# Altium project zxevo.PrjPcb (part 1 of 2)
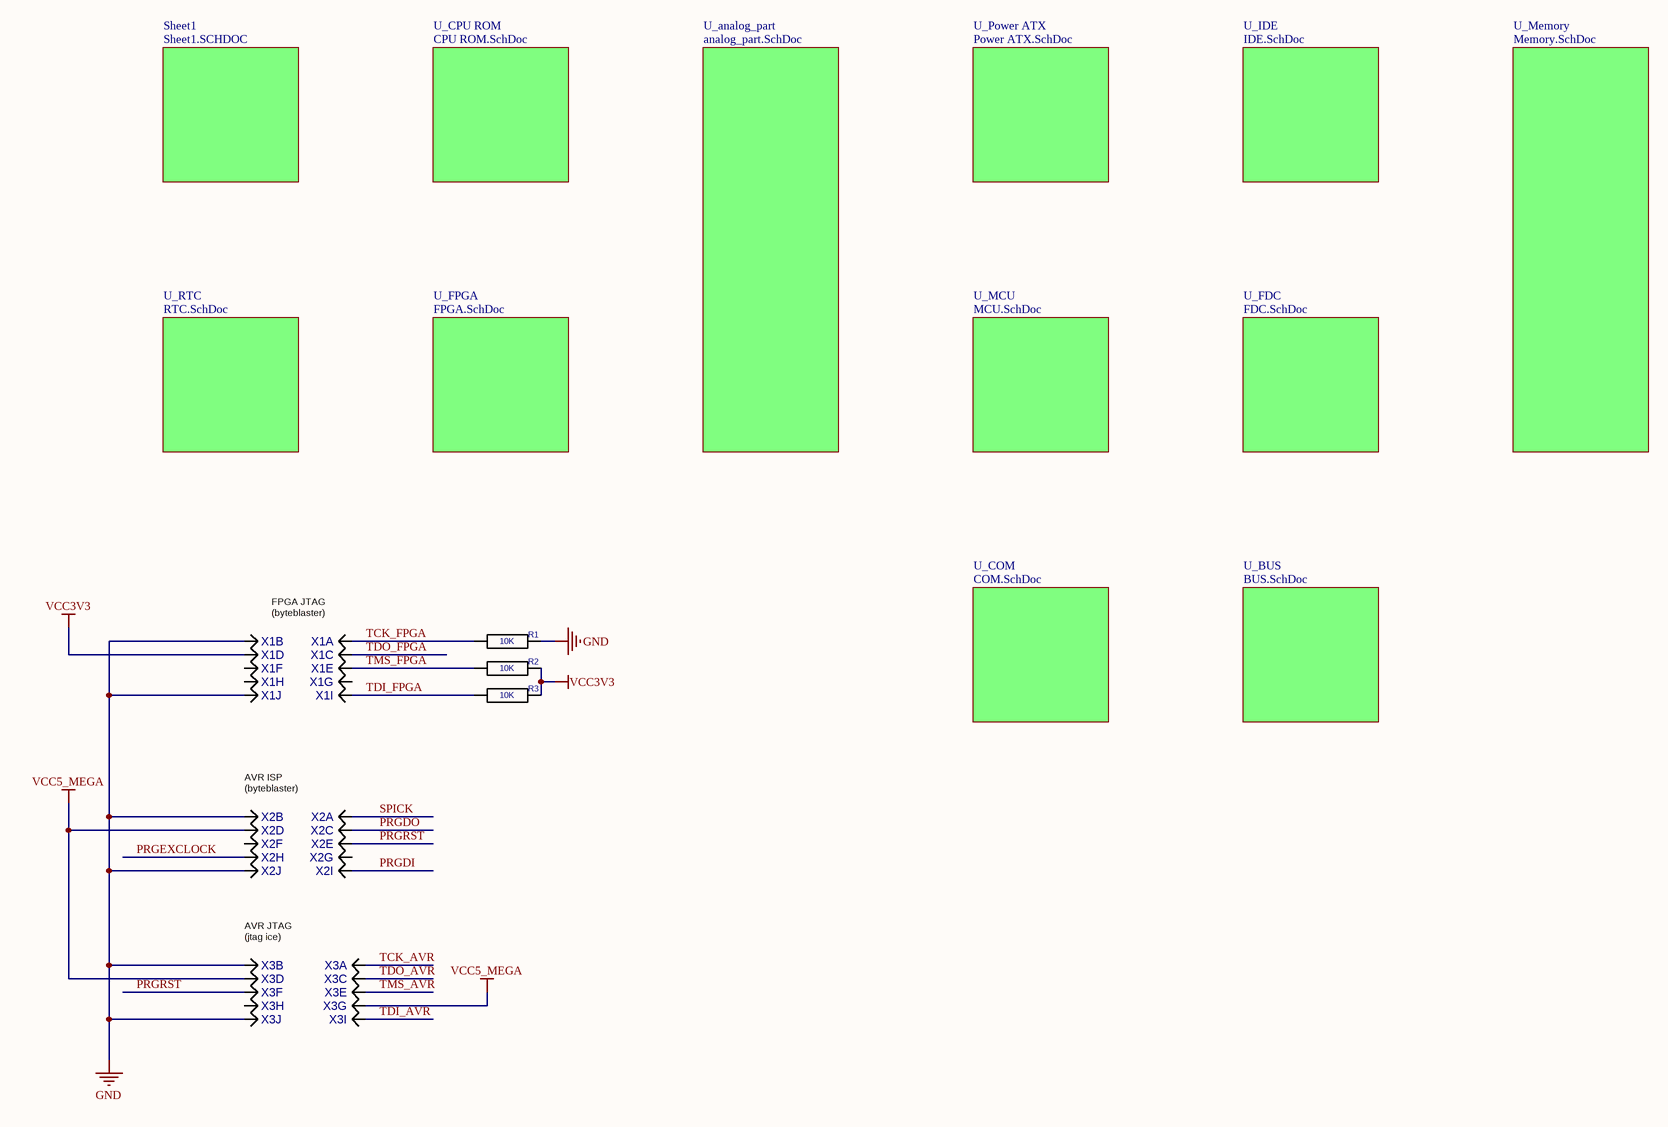
[diagram p0: First_Sheet.SCHDOC]
16 sheets, 260 parts. Net scope: global (net labels, ports and power ports of the same name join across sheets).
Board file: zxevo_c2.PcbDoc
Sheets:
  First_Sheet.SCHDOC
    Sheet1 = Sheet1.SCHDOC
    U_analog_part = analog_part.SchDoc
      U_Tape = Tape.SchDoc
      U_AY Amp = AY Amp.SchDoc
      U_Video out = Video out.SchDoc
    U_Power ATX = Power ATX.SchDoc
    U_RTC = RTC.SchDoc
    U_FPGA = FPGA.SchDoc
    U_MCU = MCU.SchDoc
    U_IDE = IDE.SchDoc
    U_FDC = FDC.SchDoc
    U_Memory = Memory.SchDoc
    U_COM = COM.SchDoc
    U_BUS = BUS.SchDoc
    U_CPU ROM = CPU ROM.SchDoc

## Sheet First_Sheet.SCHDOC
size 558 x 431 mm

### Parts
R1  value 10K  [R-CHIP]  (hidden comment: RESCHIP)
R2  value 10K  [R-CHIP]  (hidden comment: RESCHIP)
R3  value 10K  [R-CHIP]  (hidden comment: RESCHIP)
X1  IDC10M  [IDC10M]  (value not drawn)  (parts A,B,C,D,E,F,G,H,I,J of 10)
X2  IDC10M  [IDC10M]  (value not drawn)  (parts A,B,C,D,E,F,G,H,I,J of 10)
X3  IDC10M  [IDC10M]  (value not drawn)  (parts A,B,C,D,E,F,G,H,I,J of 10)

### Sub-sheets
Sheet1 = Sheet1.SCHDOC: no entries
U_analog_part = analog_part.SchDoc: no entries
U_BUS = BUS.SchDoc: no entries
U_COM = COM.SchDoc: no entries
U_CPU ROM = CPU ROM.SchDoc: no entries
U_FDC = FDC.SchDoc: no entries
U_FPGA = FPGA.SchDoc: no entries
U_IDE = IDE.SchDoc: no entries
U_MCU = MCU.SchDoc: no entries
U_Memory = Memory.SchDoc: no entries
U_Power ATX = Power ATX.SchDoc: no entries
U_RTC = RTC.SchDoc: no entries

### Nets
GND: R1.2(i/o1) X1.2 X1.10 X2.2 X2.10 X3.2 X3.10
VCC3V3: R2.2(i/o1) R3.2(i/o1) X1.4
VCC5_MEGA: X2.4 X3.4 X3.7
~{PRGRST}: X2.5 X3.6
PRGDI: X2.9
PRGDO: X2.3
PRGEXCLOCK: X2.8
SPICK: X2.1
TCK_AVR: X3.1
TCK_FPGA: R1.1(i/o) X1.1
TDI_AVR: X3.9
TDI_FPGA: R3.1(i/o) X1.9
TDO_AVR: X3.3
TDO_FPGA: X1.3
TMS_AVR: X3.5
TMS_FPGA: R2.1(i/o) X1.5

Not connected (* = marked no-connect by the designer): X1 6 7 8; X2 6 7; X3 8

### Notes on the sheet
- (near X1) FPGA JTAG
  (byteblaster)
- (near X2) AVR ISP
  (byteblaster)
- (near X3) AVR JTAG
  (jtag ice)

### Library data of the parts
X1-X3 = IDC10M: Value: *

## Sheet Sheet1.SCHDOC: ZX Evoliution
size 558 x 431 mm; Author: NedoPC; CompanyName: NedoPC; Revision: C; SheetNumber: 1; SheetTotal: 2; DocumentName: Sheet1.SCHDOC
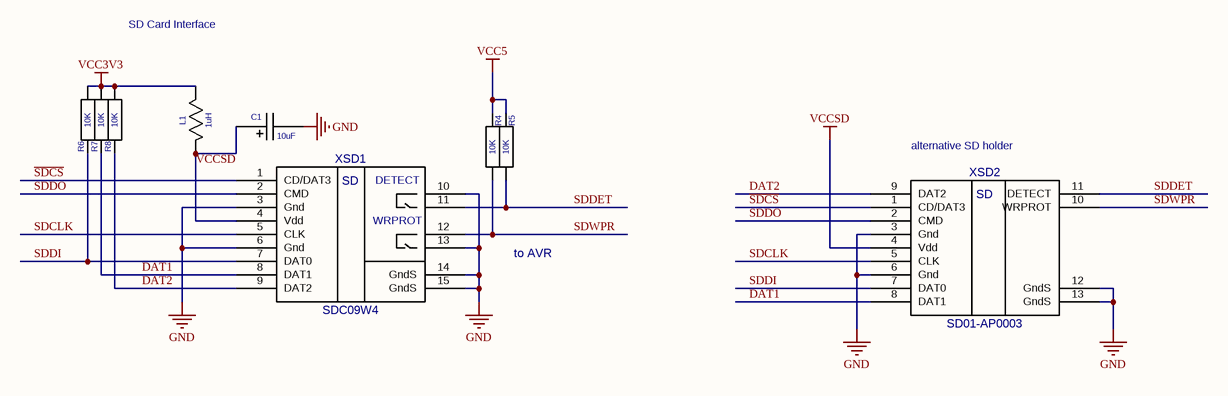
[diagram p1: Sheet1.SCHDOC]

### Parts
C1  value 10uF  [EC-CHIP]  (hidden comment: ECAPCHIP)
L1  value 1uH  [L-CHIP]  (hidden comment: L-CHIP)
R4  value 10K  [R-CHIP]  (hidden comment: RESCHIP)
R5  value 10K  [R-CHIP]  (hidden comment: RESCHIP)
R6  value 10K  [R-CHIP]  (hidden comment: RESCHIP)
R7  value 10K  [R-CHIP]  (hidden comment: RESCHIP)
R8  value 10K  [R-CHIP]  (hidden comment: RESCHIP)
XSD1  SDC09W4  [SDC09W4]
XSD2  SD01-AP0003  [SD01-AP0003]

### Nets
GND: C1.2 XSD1.3(Gnd) XSD1.6(Gnd) XSD1.10(DETECT) XSD1.13(WRPROT) XSD1.14(GndS) XSD1.15(GndS) XSD2.3(Gnd) XSD2.6(Gnd) XSD2.12(GndS) XSD2.13(GndS)
VCC3V3: L1.1 R6.1(i/o) R7.1(i/o) R8.1(i/o)
VCC5: R4.2(i/o1) R5.2(i/o1)
VCCSD: C1.1 L1.2 XSD1.4(Vdd) XSD2.4(Vdd)
DAT1: R7.2(i/o1) XSD1.8(DAT1) XSD2.8(DAT1)
DAT2: R8.2(i/o1) XSD1.9(DAT2) XSD2.9(DAT2)
~{SDCS}: XSD1.1(CD/DAT3) XSD2.1(CD/DAT3)
SDCLK: XSD1.5(CLK) XSD2.5(CLK)
SDDET: R5.1(i/o) XSD1.11(DETECT) XSD2.11(DETECT)
SDDI: R6.2(i/o1) XSD1.7(DAT0) XSD2.7(DAT0)
SDDO: XSD1.2(CMD) XSD2.2(CMD)
SDWPR: R4.1(i/o) XSD1.12(WRPROT) XSD2.10(WRPROT)

Not connected (* = marked no-connect by the designer): XSD2 14 15

### Notes on the sheet
- SD Card Interface
- (near XSD2) alternative SD holder
- to AVR
- A
- B
- C
- D
- E
- F
- 1
- 2
- 3
- 4
- Title
- Size
- A2
- Company
- Rev
- Date
- Filename
- Drawn by
- Sheet
- of
- (in symbol SD01-AP0003) SD
- (in symbol SDC09W4) SD

### Library data of the parts
XSD1 = SDC09W4: Value: *
XSD2 = SD01-AP0003: Value: *

## Sheet analog_part.SchDoc
size A4
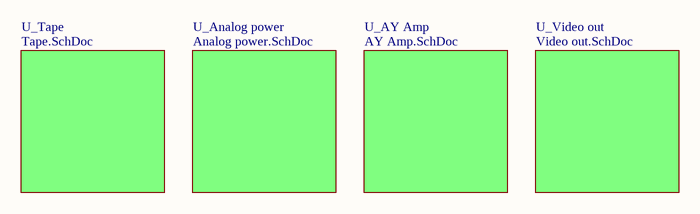
[diagram p2: analog_part.SchDoc]

### Sub-sheets
U_Analog power = Analog power.SchDoc (file not in this document): no entries
U_AY Amp = AY Amp.SchDoc: no entries
U_Tape = Tape.SchDoc: no entries
U_Video out = Video out.SchDoc: no entries

## Sheet Tape.SchDoc
size A4
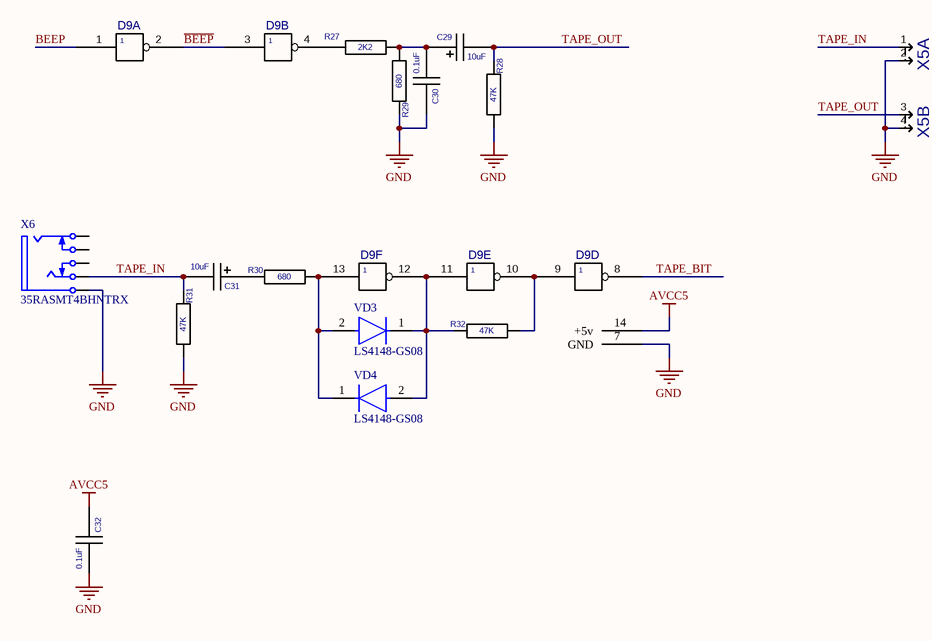
[diagram p3: Tape.SchDoc]

### Parts
C29  value 10uF  [EC-CHIP]  (hidden comment: ECAPCHIP)
C30  value 0.1uF  [C-CHIP]  (hidden comment: CAPCHIP)
C31  value 10uF  [EC-CHIP]  (hidden comment: ECAPCHIP)
C32  value 0.1uF  [C-CHIP]  (hidden comment: CAPCHIP)
D9  CD4069M  [SO14]  (value not drawn)  (parts A,B,D,E,F of 6)
R27  value 2K2  [R-CHIP]  (hidden comment: RESCHIP)
R28  value 47K  [R-CHIP]  (hidden comment: RESCHIP)
R29  value 680  [R-CHIP]  (hidden comment: RESCHIP)
R30  value 680  [R-CHIP]  (hidden comment: RESCHIP)
R31  value 47K  [R-CHIP]  (hidden comment: RESCHIP)
R32  value 47K  [R-CHIP]  (hidden comment: RESCHIP)
VD3  LS4148-GS08  [FP-6_560-5006_01-4-MFG]
VD4  LS4148-GS08  [FP-6_560-5006_01-4-MFG]
X5  PLB2-2  [PLB2-2]  (value not drawn)  (parts A,B of 2)
X6  35RASMT4BHNTRX  [SWIT-35RASMT4BHNTRX_V]

### Nets
AGND: D9.7(GND)
AVCC5: C32.1 D9.14(+5v)
GND: C30.1 C32.2 D9.7(GND) R28.1(i/o) R29.2(i/o1) R31.1(i/o) X5.2 X5.4 X6.1
~{BEEP}: D9.2 D9.3
BEEP: D9.1
TAPE_BIT: D9.8
TAPE_IN: C31.2 R31.2(i/o1) X5.1 X6.3
TAPE_OUT: C29.2 R28.2(i/o1) X5.3
NetC29_1: C29.1 C30.2 R27.1(i/o) R29.1(i/o)
NetC31_1: C31.1 R30.2(i/o1)
NetD9_4: D9.4 R27.2(i/o1)
NetD9_9: D9.9 D9.10 R32.1(i/o)
NetD9_11: D9.11 D9.12 R32.2(i/o1) VD3.1(C) VD4.2(A)
NetD9_13: D9.13 R30.1(i/o) VD3.2(A) VD4.1(C)

Not connected (* = marked no-connect by the designer): X6 2 4 5

### Library data of the parts
VD3 VD4 = CMP-02540-000025-1: DIODE GEN PURP 75V 150MA SOD80; Manufacturer: Vishay Semiconductor Diodes Division; Max Junction Temp: +175°C; Capacitance: 4pF; Value: 4pF; Forward Current: 300mA; Peak Reverse Current: 5uA; Max Repetitive Reverse Voltage: 100V; Automotive Grade: Grade 0; Max Surge Forward Current: 2A; RoHS: TRUE; Mouser Description: LS4148 Series 100 V 150 mA Small Signal Fast Switching Diode - QuadroMELF SOD-80; Octopart: https://octopart.com/ls4148-gs08-vishay-55401771; Height: 1.6mm; Reverse Voltage: 75V; Temperature Range High: +175°C; Device Class L2: Diodes; Category: Diode; Temperature: to +175°C; Device Class L3: Rectifier Diodes; Automotive: Yes; Device Class L1: Discrete Semiconductors; ComponentLink2URL: http://www.vishay.com/docs/85561/ls4148.pdf; Manufacturer Part Number: LS4148-GS08; Package: 6.560-5006.01-4; Lead Free: Yes; ComponentLink2Description: Datasheet; Digikey Description: DIODE GEN PURP 75V 150MA SOD80
X6 = CMP-1772-00001-1: Female 3.5 mm Phone Jack, 5 Position, Height 5 mm, RoHS, Tape and Reel; Current Rating: 50 mA; Voltage Rating (DC): 12 V; ComponentLink1URL: http://www.switchcraft.com/; ComponentLink2Description: Datasheet; ComponentLink2URL: http://www.switchcraft.com/Drawings/35rasmt4bhntrx_cd.pdf; PackageDescription: Female 3.5 mm Phone Jack, 5 Position, Height 5 mm; PackageReference: 35RASMT4BHNTRX; Mount: Through Hole; DatasheetVersion: Rev. C, 07/2014; Contact Material: Silver; ComponentLink1Description: Manufacturer URL; Packaging: Tape and Reel; RoHSCompliant: true; Contact Plating: Silver; Package Quantity: 3000
X5 = PLB2-2: Value: *

## Sheet AY Amp.SchDoc
size A3
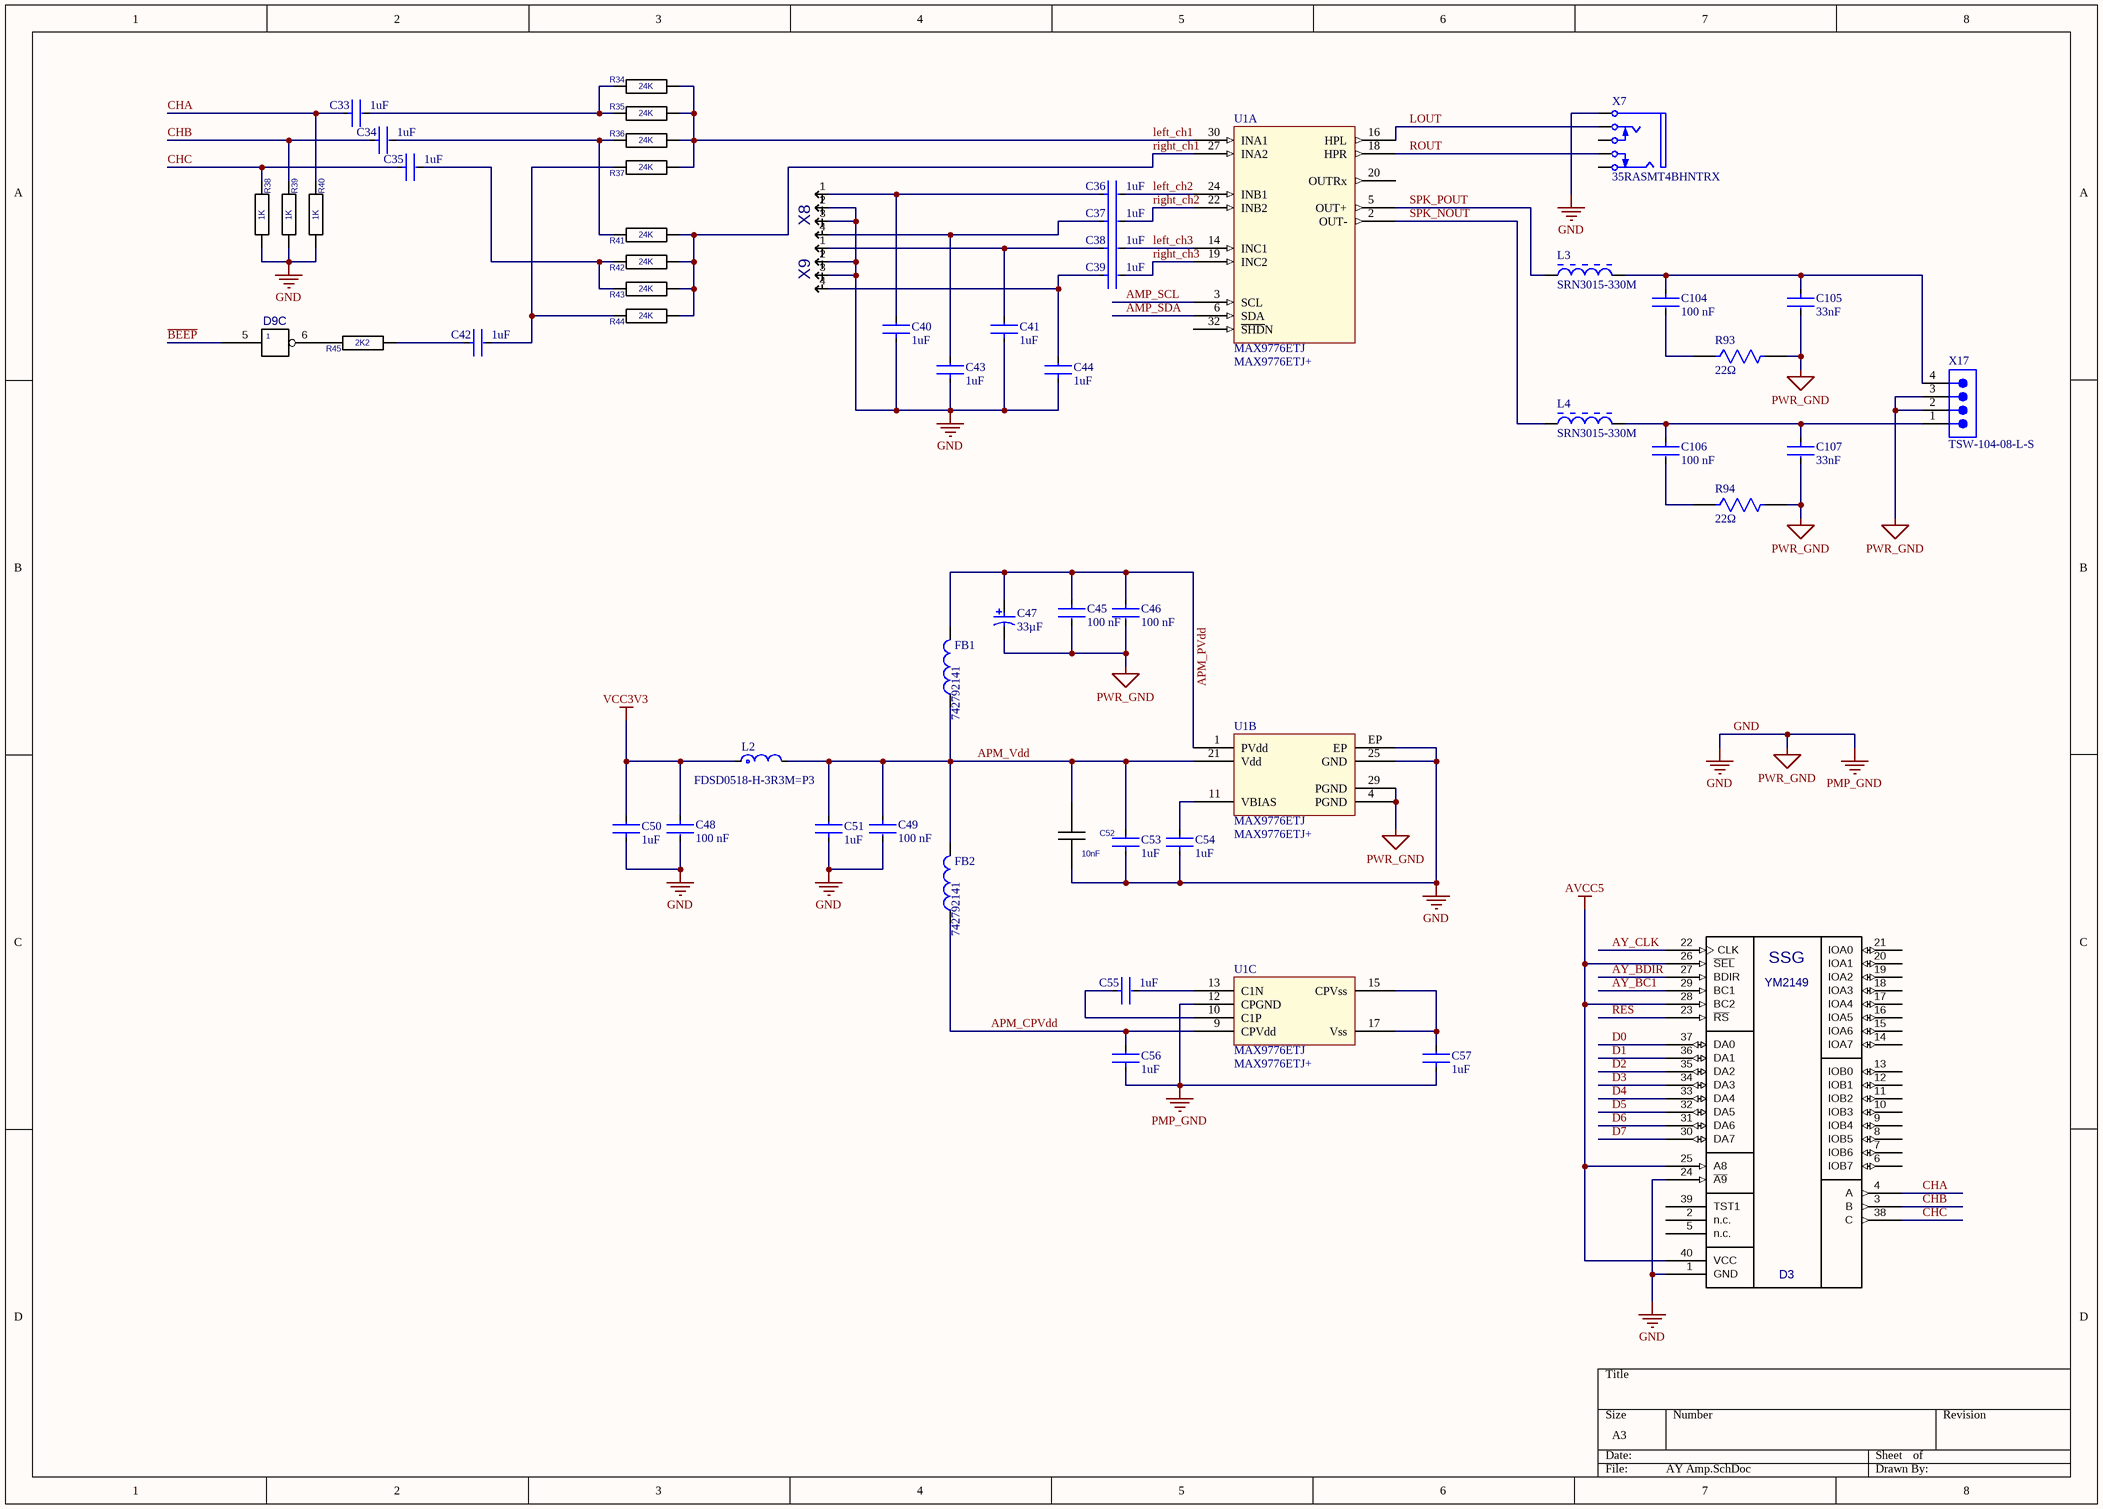
[diagram p4: AY Amp.SchDoc]

### Parts
C33  Capacitance: 1uF  [FP-GCM21B-0_15-IPC_A]  (hidden comment: GCM21BR71E105KA56L)
C34  Capacitance: 1uF  [FP-GCM21B-0_15-IPC_A]  (hidden comment: GCM21BR71E105KA56L)
C35  Capacitance: 1uF  [FP-GCM21B-0_15-IPC_A]  (hidden comment: GCM21BR71E105KA56L)
C36  Capacitance: 1uF  [FP-GCM21B-0_15-IPC_A]  (hidden comment: GCM21BR71E105KA56L)
C37  Capacitance: 1uF  [FP-GCM21B-0_15-IPC_A]  (hidden comment: GCM21BR71E105KA56L)
C38  Capacitance: 1uF  [FP-GCM21B-0_15-IPC_A]  (hidden comment: GCM21BR71E105KA56L)
C39  Capacitance: 1uF  [FP-GCM21B-0_15-IPC_A]  (hidden comment: GCM21BR71E105KA56L)
C40  Capacitance: 1uF  [FP-GCM21B-0_15-IPC_A]  (hidden comment: GCM21BR71E105KA56L)
C41  Capacitance: 1uF  [FP-GCM21B-0_15-IPC_A]  (hidden comment: GCM21BR71E105KA56L)
C42  Capacitance: 1uF  [FP-GCM21B-0_15-IPC_A]  (hidden comment: GCM21BR71E105KA56L)
C43  Capacitance: 1uF  [FP-GCM21B-0_15-IPC_A]  (hidden comment: GCM21BR71E105KA56L)
C44  Capacitance: 1uF  [FP-GCM21B-0_15-IPC_A]  (hidden comment: GCM21BR71E105KA56L)
C45  Capacitance: 100 nF  [FP-CC0805-0_85-IPC_A]  (hidden comment: CC0805KRX7R8BB104)
C46  Capacitance: 100 nF  [FP-CC0805-0_85-IPC_A]  (hidden comment: CC0805KRX7R8BB104)
C47  Capacitance: 33µF  [CAPMP3529X21-T_V]  (hidden comment: TAJB336K016RNJ)
C48  Capacitance: 100 nF  [FP-CC0805-0_85-IPC_A]  (hidden comment: CC0805KRX7R8BB104)
C49  Capacitance: 100 nF  [FP-CC0805-0_85-IPC_A]  (hidden comment: CC0805KRX7R8BB104)
C50  Capacitance: 1uF  [FP-GCM21B-0_15-IPC_A]  (hidden comment: GCM21BR71E105KA56L)
C51  Capacitance: 1uF  [FP-GCM21B-0_15-IPC_A]  (hidden comment: GCM21BR71E105KA56L)
C52  value 10nF  [C-CHIP]  (hidden comment: CAPCHIP)
C53  Capacitance: 1uF  [FP-GCM21B-0_15-IPC_A]  (hidden comment: GCM21BR71E105KA56L)
C54  Capacitance: 1uF  [FP-GCM21B-0_15-IPC_A]  (hidden comment: GCM21BR71E105KA56L)
C55  Capacitance: 1uF  [FP-GCM21B-0_15-IPC_A]  (hidden comment: GCM21BR71E105KA56L)
C56  Capacitance: 1uF  [FP-GCM21B-0_15-IPC_A]  (hidden comment: GCM21BR71E105KA56L)
C57  Capacitance: 1uF  [FP-GCM21B-0_15-IPC_A]  (hidden comment: GCM21BR71E105KA56L)
C104  Capacitance: 100 nF  [FP-CC0805-0_85-IPC_A]  (hidden comment: CC0805KRX7R8BB104)
C105  Capacitance: 33nF  [FP-CL21-IPC_A]  (hidden comment: CL21B333KBANNNC)
C106  Capacitance: 100 nF  [FP-CC0805-0_85-IPC_A]  (hidden comment: CC0805KRX7R8BB104)
C107  Capacitance: 33nF  [FP-CL21-IPC_A]  (hidden comment: CL21B333KBANNNC)
D3  YM2149  [DIP40]
D9  CD4069M  [SO14]  (value not drawn)  (part C of 6)
FB1  742792141  [SMD-1206]
FB2  742792141  [SMD-1206]
L2  FDSD0518-H-3R3M=P3  [FP-FDSD0518-MFG]
L3  SRN3015-330M  [BOUR-SRN3015-2_V]
L4  SRN3015-330M  [BOUR-SRN3015-2_V]
R34  value 24K  [R-CHIP]  (hidden comment: RESCHIP)
R35  value 24K  [R-CHIP]  (hidden comment: RESCHIP)
R36  value 24K  [R-CHIP]  (hidden comment: RESCHIP)
R37  value 24K  [R-CHIP]  (hidden comment: RESCHIP)
R38  value 1K  [R-CHIP]  (hidden comment: RESCHIP)
R39  value 1K  [R-CHIP]  (hidden comment: RESCHIP)
R40  value 1K  [R-CHIP]  (hidden comment: RESCHIP)
R41  value 24K  [R-CHIP]  (hidden comment: RESCHIP)
R42  value 24K  [R-CHIP]  (hidden comment: RESCHIP)
R43  value 24K  [R-CHIP]  (hidden comment: RESCHIP)
R44  value 24K  [R-CHIP]  (hidden comment: RESCHIP)
R45  value 2K2  [R-CHIP]  (hidden comment: RESCHIP)
R93  Resistance: 22Ω  [FP-AC0805-IPC_A]  (hidden comment: AC0805JR-0722RL)
R94  Resistance: 22Ω  [FP-AC0805-IPC_A]  (hidden comment: AC0805JR-0722RL)
U1  MAX9776ETJ  Supplier Part Number 1: MAX9776ETJ+  [QFN50P500X500X75_HS-33M]  (parts A,B,C of 3)
X7  35RASMT4BHNTRX  [SWIT-35RASMT4BHNTRX_V]
X8  PLB1-4I  [PLB1-4I]  (value not drawn)
X9  PLB1-4I  [PLB1-4I]  (value not drawn)
X17  TSW-104-08-L-S  [SMTC-TSW-104-08-X-S]

### Nets
AGND: D9.7(GND)
AVCC5: D3.25(A8) D3.26(~{SEL}) D3.28(BC2) D3.40(VCC) D9.14(+5v)
GND: C40.1 C41.1 C43.1 C44.1 C45.2 C46.2 C47.2 C48.2 C49.2 C50.1 C51.1 C52.2 C53.1 C54.1 C56.1 C57.1 C105.2 C107.2 D3.1(GND) D3.24(~{A9}) R38.1(i/o) R39.1(i/o) R40.1(i/o) R93.2 R94.2 U1.4(PGND) U1.12(CPGND) U1.25(GND) U1.29(PGND) U1.EP X7.1 X8.2(I/O2) X8.3(I/O3) X9.2(I/O2) X9.3(I/O3) X17.2 X17.3  [also labelled PMP_GND, PWR_GND]
VCC3V3: C48.1 C50.2 L2.1
AMP_SCL: U1.3(SCL)
AMP_SDA: U1.6(SDA)
APM_CPVdd: C56.2 FB2.1 U1.9(CPVdd)
APM_PVdd: C45.1 C46.1 C47.1 FB1.2 U1.1(PVdd)
APM_Vdd: C49.1 C51.2 C52.1 C53.2 FB1.1 FB2.2 L2.2 U1.21(Vdd)
AY_BC1: D3.29(BC1)
AY_BDIR: D3.27(BDIR)
AY_CLK: D3.22(CLK)
~{BEEP}: D9.5
CHA: C33.1 D3.4(A) R40.2(i/o1)
CHB: C34.1 D3.3(B) R39.2(i/o1)
CHC: C35.1 D3.38(C) R38.2(i/o1)
D0: D3.37(DA0)
D1: D3.36(DA1)
D2: D3.35(DA2)
D3: D3.34(DA3)
D4: D3.33(DA4)
D5: D3.32(DA5)
D6: D3.31(DA6)
D7: D3.30(DA7)
left_ch1: R34.1(i/o) R35.1(i/o) R36.1(i/o) R37.1(i/o) U1.30(INA1)
left_ch2: C36.2 U1.24(INB1)
left_ch3: C38.2 U1.14(INC1)
LOUT: U1.16(HPL) X7.3
~{RES}: D3.23(~{RS})
right_ch1: R41.1(i/o) R42.1(i/o) R43.1(i/o) R44.1(i/o) U1.27(INA2)
right_ch2: C37.2 U1.22(INB2)
right_ch3: C39.2 U1.19(INC2)
ROUT: U1.18(HPR) X7.4
SPK_NOUT: L4.1 U1.2(OUT-)
SPK_POUT: L3.1 U1.5(OUT+)
NetC33_2: C33.2 R34.2(i/o1) R35.2(i/o1)
NetC34_2: C34.2 R36.2(i/o1) R41.2(i/o1)
NetC35_2: C35.2 R42.2(i/o1) R43.2(i/o1)
NetC36_1: C36.1 C40.2 X8.1(I/O1)
NetC37_1: C37.1 C43.2 X8.4(I/O4)
NetC38_1: C38.1 C41.2 X9.1(I/O1)
NetC39_1: C39.1 C44.2 X9.4(I/O4)
NetC42_1: C42.1 R45.1(i/o)
NetC42_2: C42.2 R37.2(i/o1) R44.2(i/o1)
NetC54_2: C54.2 U1.11(VBIAS)
NetC55_1: C55.1 U1.10(C1P)
NetC55_2: C55.2 U1.13(C1N)
NetC57_2: C57.2 U1.15(CPVss) U1.17(Vss)
NetC104_1: C104.1 C105.1 L3.2 X17.4
NetC104_2: C104.2 R93.1
NetC106_1: C106.1 C107.1 L4.2 X17.1
NetC106_2: C106.2 R94.1
NetD9_6: D9.6 R45.2(i/o1)

Not connected (* = marked no-connect by the designer): D3 2(n.c.) 5(n.c.) 6(IOB7) 7(IOB6) 8(IOB5) 9(IOB4) 10(IOB3) 11(IOB2) 12(IOB1) 13(IOB0) 14(IOA7) 15(IOA6) 16(IOA5) 17(IOA4) 18(IOA3) 19(IOA2) 20(IOA1) 21(IOA0) 39(TST1); U1 7(I.C.) 8(I.C.) 20(OUTRx) 23(I.C.) 26(I.C.) 28(I.C.) 31(I.C.) 32(~{SHD}N); X7 2 5

### Notes on the sheet
- (in symbol YM2149) SSG

### Library data of the parts
C33-C44 C50 C51 C53-C57 = CMP-2007-03346-2: Ceramic Capacitor for Automotive 1uF ±10% 25VDC X7R 0805 Embossed T/R; Voltage Rating (DC): 25V; Dielectric: X7R; Max Operating Temperature: 125°C; Lead Free: Lead Free; Ratings: AEC-Q200; Voltage Rating: 25V; Case Code (Imperial): 0805; Package Quantity: 3000; Termination: SMD/SMT; Packaging: Tape and Reel; Tolerance: 10%; Length: 2mm; Voltage: 25V; Radiation Hardening: No; Depth: 1.25mm; Case/Package: 0805; Thickness: 0.055inch; Width: 0.049inch; Min Operating Temperature: -55°C; Mount: Surface Mount; REACH SVHC: No SVHC; Case Code (Metric): 2012; Height: 1.25mm
C45 C46 C48 C49 C104 C106 = CMP-1036-04410-2: CAP CER 0.1UF 25V X7R 0805; Manufacturer: Yageo; Tolerance: 0.1; Material: Ceramic; Value: 100 nF; ComponentLink2URL: http://www.yageo.com/documents/recent/UPY-GPHC_Y5V_6.3V-to-50V_8.pdf; Category: Cap; Mouser Description: Multilayer Ceramic Capacitors MLCC - SMD/SMT 100nF 25V X7R 10%; Manufacturer Part Number: CC0805KRX7R8BB104; Device Class L1: Passive Components; Footprint Url: http://www.yageo.com/exep/pages/download/literatures/UPY-C_GEN_24.pdf; Height: 0.95mm; Digikey Description: CAP CER 0.1UF 25V X7R 0805; Lead Free: Yes; Temperature Range High: +85°C; Temperature: -30°C to +85°C; Ipc Land Pattern Name: CAPC200125X85; Automotive: No; Octopart: https://octopart.com/cc0805krx7r8bb104-yageo-39467766; Device Class L2: Capacitors; Temperature Characteristic: X7R; Voltage Rating: 25 V; ComponentLink2Description: Datasheet; Temperature Range Low: -30°C; Device Class L3: Ceramic Capacitors; RoHS: TRUE; Package: CC0805-0.85
C47 = CMP-2000-07224-1: Standard Tantalum, 33 uF, +/- 10%, 16 V, -55 to 125 degC, 2-Pin SMD, RoHS, Tape and Reel; Manufacturer: AVX; Manufacturer Size Code: B; PCN Part Number: TAJSeriesSuffix08/Dec/2008; Other Names: 478-1688-1; Kits: 478-3443-ND-KITTANTCAPTAJSERIES; Product Training Modules: ComponentSolutionsforSmartMeterApplications; Catalog Drawings: TAJSeriesSideTAJSeries; ESR (Equivalent Series Resistance): 2.1Ohm; EDA / CAD Models: DownloadfromAcceleratedDesigns; Voltage - Rated: 16V; Type: Molded; Online Catalog: TAJSeries; Lead Spacing: -; Family: TantalumCapacitors; Series: TAJ; Package Reference: CAPMP3529X21-T; Package / Case: 1210(3528Metric); Category: Capacitors; Packaging: CutTape(CT); Lifetime @ Temp.: -; Package URL: http://www.avx.com/download/software/literature/AVX-Footprint-Library.pdf; Tolerance: ±10%; Manufacturer URL: http://www.avx.com/; Package Description: 2-Pin Surface Mount Device, Body 3.5 x 2.85 mm; Features: GeneralPurpose; Height - Seated (Max): 0.083"(2.10mm); Mounting Technology: SurfaceMount; Datasheet Version: 02/2016; Datasheet URL: http://datasheets.avx.com/TAJ.pdf; Operating Temperature: -55°C~125°C; Standard Package: 1; Size / Dimension: 0.138"Lx0.110"W(3.50mmx2.80mm); Mounting Type: SurfaceMount
C105 C107 = CMP-13271-001257-1: CL21 Series 0805 33nF 50V ±10% Tolerance X7R Multilayer Ceramic Chip Capacitor; Lead Free: Lead Free; Case Code (Imperial): 0805; Case/Package: 0805; Depth: 1.25mm; Package Quantity: 1; Radiation Hardening: No; Max Operating Temperature: 125°C; Min Operating Temperature: -55°C; Length: 2mm; Voltage Rating (DC): 50V; Material: Ceramic; Thickness: 0.03inch; Height: 0.65mm; Voltage Rating: 50V; Dielectric: X7R; Mount: Surface Mount; Voltage: 50V; Tolerance: 10%; Width: 0.049inch; Case Code (Metric): 2012; Packaging: Tape and Reel
FB1 FB2 = CMP-0220-00011-1: SMD EMI Suppression Ferrite Bead WE-CBF, Z = 1000 Ohm; Impedance: 1000 Ohm; PackageReference: SMD-1206; ComponentLink1URL: http://www.we-online.com; PackageVersion: 2007; DatasheetVersion: Dec-2005; ComponentLink1Description: Manufacturer Link; PackageDescription: Chip Inductor, 2-Leads, Body 3.2 x 1.6 mm; ComponentLink2Description: Datasheet; ComponentLink2URL: http://www.we-online.de/katalog/media/pdf/742792141.pdf
L2 = CMP-06042-016056-1: FIXED IND 3.3UH 3.4A 58 MOHM SMD; Tolerance: 20%; Saturation Current: 4.6A; DC Resistance (DCR): 58mR; Test Frequency: 100kHz; Shielding: Shielded; Core Material: Ferrite; Packaging: Tape and Reel; Current Rating: 3.4A; Resistor Type: Wirewound; Depth: 4.9mm; Inductance: 3.3uH; Width: 0.193inch; RoHS Compliant: Yes; Height - Seated (Max): 0.071inch; Mount: Surface Mount; Length: 0.205inch; Case/Package: Nonstandard; Max DC Current: 3.4A
L3 L4 = CMP-0007-00002-1: Semi-shielded Power Inductor, 33 uH, +/- 20%, 0.5 A, -40 to 125 degC, 3 x 3 x 1.5 mm SMD, RoHS and Halogen Free, Tape and Reel; Manufacturer: Bourns; DCR Max: 0.959 Ohm; Resistance to Solder Heat: +260 degC for 10 sec.; Inductance: 33 uH; Isat: 0.46 A; Rated current: 0.5 A; SRF Min: 22 MHz; Inductance tolerance: +/- 20%; Packing: Tape and Reel; PackageDescription: 2-Pin SMD, Body 3 x 3 mm, Height 1.5 mm; Operating Temperature: -40 to 125 degC; Mounting Technology: Surface Mount; ComponentLink3Description: Package Specification; DatasheetVersion: Aug-11; ComponentLink3URL: http://www.bourns.com/data/global/pdfs/SRN3015.pdf; RoHS: TRUE; PartNumber: SRN3015-330M; ComponentLink2Description: Datasheet; ComponentLink2URL: http://www.bourns.com/data/global/pdfs/SRN3015.pdf; ComponentLink1Description: Manufacturer URL; PackageReference: SRN3015; ComponentLink1URL: http://www.bourns.com/
R93 R94 = CMP-03412-037428-1: RES SMD 22 OHM 5% 1/8W 0805; Manufacturer: Yageo; Value: 22Ω; Automotive Grade: Grade 0; Voltage Rating: 150V; Tolerance: 0.05; Temperature Range High: +155°C; Ipc Land Pattern Name: RESC200125X50; Series: AC; Temperature: -55°C to +155°C; Octopart: https://octopart.com/ac0805jr-0722rl-yageo-25972001; Digikey Description: RES SMD 22 OHM 5% 1/8W 0805; Height: 0.6mm; ComponentLink2URL: http://www.yageo.com/documents/recent/PYu-AC_51_RoHS_L_6.pdf; Composition: Thick Film; Automotive: Yes; Mouser Description: Thick Film Resistors 1/8W 22ohm 5% AEC-Q200; Device Class L3: Chip SMD Resistors; Device Class L2: Resistors; Power Rating: 1/8W; Device Class L1: Passive Components; Category: Res; RoHS: TRUE; ComponentLink2Description: Datasheet; Temperature Range Low: -55°C; Package: AC0805; Footprint Url: http://www.yageo.com/exep/pages/download/literatures/PYu-R_Mount_10.pdf; Lead Free: Yes; Manufacturer Part Number: AC0805JR-0722RL
U1 = MAX9776ETJ: Audio Amp Headphone/Receiver/Speaker 1-CH Mono/2-CH Stereo 1.5W Class-D 32-Pin TQFN EP; Manufacturer: Maxim; Voltage Gain: 12dB; Min Dual Supply Voltage: 2.7V; Max Dual Supply Voltage: 5.5V; Power Supply Rejection Ratio (PSRR): 80dB; Common Mode Rejection Ratio: 45dB; Max Power Dissipation: 1.36W; Nominal Supply Current: 9.5mA; Dual Supply Voltage: 5V; Supply Type: Triple; Gain Bandwidth Product: 20kHz; Manufacturer Part Number: MAX9776ETJ+; RoHS: Yes; Category: Amplifiers - Audio; Stock 1: 240; Mount: Surface Mount; Number of Pins: 32; Min Operating Temperature: -40°C; Max Operating Temperature: 85°C; Packaging: Rail/Tube; Max Output Power: 1.5W; Package Quantity: 1; Logic Function: Receiver; Features: I²C; Output Power: 1.5W; Max Supply Voltage: 5.5V; Min Supply Voltage: 2.7V; Series: DirectDrive®; Supply Current: 9.5mA; Length: 5.1mm; Width: 5.1mm; Height: 0.75mm; Radiation Hardening: No; RoHS Compliant: Yes; ComponentLink1URL: https://datasheet.ciiva.com/1790/max9775-max9776-1790309.pdf?src-supplier=Digi-Key; ComponentLink1Description: https://datasheet.ciiva.com/1790/max9775-max9776-1790309.pdf?src-supplier=Digi-Key; ComponentLink2URL: https://datasheet.ciiva.com/17309/max9775-max9776-17309659.pdf?src-supplier=Avnet+Europe; ComponentLink2Description: https://datasheet.ciiva.com/17309/max9775-max9776-17309659.pdf?src-supplier=Avnet+Europe; ComponentLink3URL: https://datasheet.ciiva.com/2967/max9775-max9776-2967997.pdf?src-supplier=Avnet; ComponentLink3Description: https://datasheet.ciiva.com/2967/max9775-max9776-2967997.pdf?src-supplier=Avnet
X7 = CMP-1772-00001-1: as X6 on sheet Tape; ComponentLink1URL: http://www.switchcraft.com/; ComponentLink2Description: Datasheet; ComponentLink2URL: http://www.switchcraft.com/Drawings/35rasmt4bhntrx_cd.pdf; PackageDescription: Female 3.5 mm Phone Jack, 5 Position, Height 5 mm; PackageReference: 35RASMT4BHNTRX; Mount: Through Hole; DatasheetVersion: Rev. C, 07/2014; Contact Material: Silver; ComponentLink1Description: Manufacturer URL; Packaging: Tape and Reel; RoHSCompliant: true; Contact Plating: Silver; Package Quantity: 3000
X17 = CMP-1024-00358-1: 0.025" SQ Post Header, Through-hole, Vertical, -55 to 125 degC, 2.54 mm Pitch, 4-Pin, Male, RoHS; Manufacturer: Samtec; Pitch: 2.54 mm; PartNumber: TSW-104-08-L-S; RoHS: True; Temperature Range: -55 to 125 degC; PackageDescription: .025[0.64] SQ. Post Terminal Strip Assembly; Orientation: Vertical; ComponentLink2URL: http://www.samtec.com/documents/webfiles/pdf/TSW_TH.PDF; ComponentLink1Description: Manufacturer URL; ComponentLink2Description: Datasheet; PackageVersion: DM, 8/1988; ComponentLink3URL: http://www.samtec.com/documents/webfiles/cpdf/TSW-XXX-XX-XXX-X-XX-XXX-MKT.pdf; Mounting Technology: Through-hole; PackageReference: TSW-104-08-X-S; ComponentLink3Description: Package Specification; ComponentLink1URL: http://www.samtec.com; DatasheetVersion: F-214
D3 = YM2149: Value: *
X8 X9 = PLB1-4I: Value: *

## Sheet Video out.SchDoc
size A3
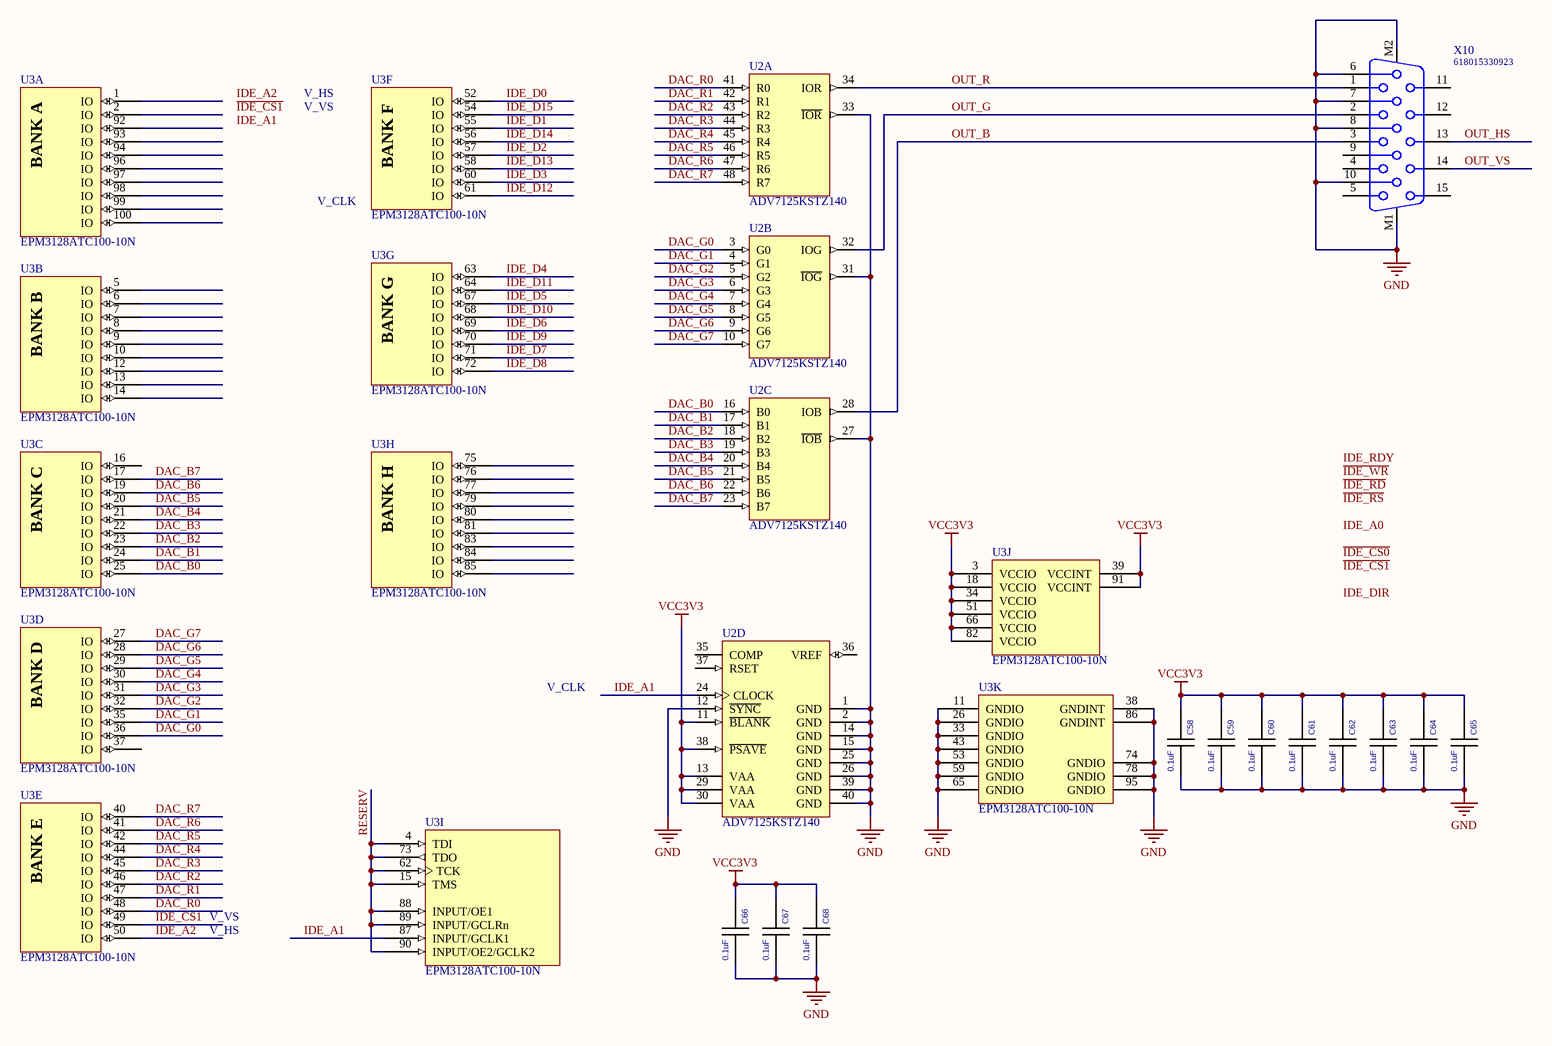
[diagram p5: Video out.SchDoc]

### Parts
C58  value 0.1uF  [C-CHIP]  (hidden comment: CAPCHIP)
C59  value 0.1uF  [C-CHIP]  (hidden comment: CAPCHIP)
C60  value 0.1uF  [C-CHIP]  (hidden comment: CAPCHIP)
C61  value 0.1uF  [C-CHIP]  (hidden comment: CAPCHIP)
C62  value 0.1uF  [C-CHIP]  (hidden comment: CAPCHIP)
C63  value 0.1uF  [C-CHIP]  (hidden comment: CAPCHIP)
C64  value 0.1uF  [C-CHIP]  (hidden comment: CAPCHIP)
C65  value 0.1uF  [C-CHIP]  (hidden comment: CAPCHIP)
C66  value 0.1uF  [C-CHIP]  (hidden comment: CAPCHIP)
C67  value 0.1uF  [C-CHIP]  (hidden comment: CAPCHIP)
C68  value 0.1uF  [C-CHIP]  (hidden comment: CAPCHIP)
U2  ADV7125KSTZ140  [ST-48_N]  (parts A,B,C,D of 4)
U3  EPM3128ATC100-10N  [ALTR-TQFP100_A-120_D1-140_L]  (parts A,B,C,D,E,F,G,H,I,J,K of 11)
X10  618015330923  [618015330923]

### Nets
GND: C58.2 C59.2 C60.2 C61.2 C62.2 C63.2 C64.2 C65.2 C66.2 C67.2 C68.2 U2.1(GND) U2.2(GND) U2.12(~{SYNC}) U2.14(GND) U2.15(GND) U2.25(GND) U2.26(GND) U2.27(~{IOB}) U2.31(~{IOG}) U2.33(~{IOR}) U2.39(GND) U2.40(GND) U3.11(GNDIO) U3.26(GNDIO) U3.33(GNDIO) U3.38(GNDINT) U3.43(GNDIO) U3.53(GNDIO) U3.59(GNDIO) U3.65(GNDIO) U3.74(GNDIO) U3.78(GNDIO) U3.86(GNDINT) U3.95(GNDIO) X10.6 X10.7 X10.8 X10.10 X10.M1 X10.M2
VCC3V3: C58.1 C59.1 C60.1 C61.1 C62.1 C63.1 C64.1 C65.1 C66.1 C67.1 C68.1 U2.11(~{BLANK}) U2.13(VAA) U2.29(VAA) U2.30(VAA) U2.38(~{PSAVE}) U3.3(VCCIO) U3.18(VCCIO) U3.34(VCCIO) U3.39(VCCINT) U3.51(VCCIO) U3.66(VCCIO) U3.82(VCCIO) U3.91(VCCINT)
DAC_B0: U2.16(B0) U3.25(IO)
DAC_B1: U2.17(B1) U3.24(IO)
DAC_B2: U2.18(B2) U3.23(IO)
DAC_B3: U2.19(B3) U3.22(IO)
DAC_B4: U2.20(B4) U3.21(IO)
DAC_B5: U2.21(B5) U3.20(IO)
DAC_B6: U2.22(B6) U3.19(IO)
DAC_B7: U2.23(B7) U3.17(IO)
DAC_G0: U2.3(G0) U3.36(IO)
DAC_G1: U2.4(G1) U3.35(IO)
DAC_G2: U2.5(G2) U3.32(IO)
DAC_G3: U2.6(G3) U3.31(IO)
DAC_G4: U2.7(G4) U3.30(IO)
DAC_G5: U2.8(G5) U3.29(IO)
DAC_G6: U2.9(G6) U3.28(IO)
DAC_G7: U2.10(G7) U3.27(IO)
DAC_R0: U2.41(R0) U3.48(IO)
DAC_R1: U2.42(R1) U3.47(IO)
DAC_R2: U2.43(R2) U3.46(IO)
DAC_R3: U2.44(R3) U3.45(IO)
DAC_R4: U2.45(R4) U3.44(IO)
DAC_R5: U2.46(R5) U3.42(IO)
DAC_R6: U2.47(R6) U3.41(IO)
DAC_R7: U2.48(R7) U3.40(IO)
~{IDE_CS1}: U3.49(IO)
IDE_A1: U2.24(CLOCK) U3.87(INPUT/GCLK1)
IDE_A2: U3.50(IO)
IDE_D0: U3.52(IO)
IDE_D1: U3.55(IO)
IDE_D2: U3.57(IO)
IDE_D3: U3.60(IO)
IDE_D4: U3.63(IO)
IDE_D5: U3.67(IO)
IDE_D6: U3.69(IO)
IDE_D7: U3.71(IO)
IDE_D8: U3.72(IO)
IDE_D9: U3.70(IO)
IDE_D10: U3.68(IO)
IDE_D11: U3.64(IO)
IDE_D12: U3.61(IO)
IDE_D13: U3.58(IO)
IDE_D14: U3.56(IO)
IDE_D15: U3.54(IO)
OUT_B: U2.28(IOB) X10.3
OUT_G: U2.32(IOG) X10.2
OUT_HS: X10.13
OUT_R: U2.34(IOR) X10.1
OUT_VS: X10.14
RESERV: U3.4(TDI) U3.15(TMS) U3.62(TCK) U3.73(TDO) U3.88(INPUT/OE1) U3.89(INPUT/GCLRn) U3.90(INPUT/OE2/GCLK2)

Not connected (* = marked no-connect by the designer): U2 35(COMP) 36(VREF) 37(RSET); U3 1(IO) 2(IO) 5(IO) 6(IO) 7(IO) 8(IO) 9(IO) 10(IO) 12(IO) 13(IO) 14(IO) 16(IO) 37(IO) 75(IO) 76(IO) 77(IO) 79(IO) 80(IO) 81(IO) 83(IO) 84(IO) 85(IO) 92(IO) 93(IO) 94(IO) 96(IO) 97(IO) 98(IO) 99(IO) 100(IO); X10 4 5 9 11 12 15

### Notes on the sheet
- V_HS
- V_VS
- V_CLK
- Labels drawn without touching a wire or pin: IDE_A0, IDE_A1, IDE_A2, IDE_DIR, IDE_RDY, ~{IDE_CS0}, ~{IDE_CS1}, ~{IDE_RD}, ~{IDE_RS}, ~{IDE_WR}
- (in symbol CMP-2000-06227-1, part A) BANK A
- (in symbol CMP-2000-06227-1, part B) BANK B
- (in symbol CMP-2000-06227-1, part C) BANK C
- (in symbol CMP-2000-06227-1, part D) BANK D
- (in symbol CMP-2000-06227-1, part E) BANK E
- (in symbol CMP-2000-06227-1, part F) BANK F
- (in symbol CMP-2000-06227-1, part G) BANK G
- (in symbol CMP-2000-06227-1, part H) BANK H

### Library data of the parts
U2 = CMP-0318-00718-2: 3 Channel 8-Bit CMOS High Speed Video Digital-to-Analog Converter, -40 to +85 degC, ST-48, Pb-Free, Tray; Manufacturer: Analog Devices; Max V+: 5.25V; Op Pwr Diss: 485mW; Resolution (Bits): 8; # DAC Outputs: 3; Single Supply: No; ComponentLink3URL: http://www.analog.com/static/imported-files/packages/PKG_PDF/LQFP%28ST%29/ST_48.pdf; PackageDescription: 48-Pin Thin Quad Flat Pack 0.5 mm Pitch; Generic Part Number: ADV7125; ComponentLink2Description: Datasheet; ComponentLink1URL: http://www.analog.com/en/index.html; ComponentLink2URL: http://www.analog.com/static/imported-files/data_sheets/ADV7125.pdf; ComponentLink3Description: Package Specification; Packing: Tray; PartNumber: ADV7125KSTZ140; DatasheetVersion: Rev.C; PackageVersion: revA; ComponentLink4Description: Product URL; PackageReference: ST-48; ComponentLink4URL: http://www.analog.com/en/digital-to-analog-converters/da-converters/adv7125/products/product.html; RevisionNote: Component URL fixed; ComponentLink1Description: Manufacturer URL; RoHS: Y; Mounting Technology: Surface Mount
U3 = CMP-2000-06227-1: MAX(R) 3000A CPLD, 80 I/Os, Speed Grade 5, Commercial Grade, 100-Pin TQFP, RoHS; Manufacturer: Altera; Frequency: 98MHz; CPLD Type: EEPROM; No. of Pins: 100; Supply Voltage Max: 3.6V; No. of I/O's: 80; IC Generic Number: 3128; Supply Voltage: 3.3V; Propagation Delay: 10ns; Supply Voltage Range: 3Vto3.6V; Logic IC Function: PLD; I/O Interface Standard: CMOS,TTL; Global Clock Setup Time: 6.6ns; No. of Macrocells: 128; Package Version: Rev. 16.8, 12/2011; No. of Gates: 2500; Supply Voltage Min: 3V; SVHC: NoSVHC(19-Dec-2011); Operating Temperature Min: 0°C; Series: MAX3000A; Package / Case: TQFP; Logic Case Style: TQFP; Manufacturer URL: https://www.altera.com/; Logic Function Number: 3128; Datasheet Version: Rev. 3.5, 06/2006; Package Description: 100-Pin Plastic Thin Quad Flat Pack (TQFP), Body 14 x 14 mm, Pitch 0.5 mm; Package URL: https://www.altera.com/content/dam/altera-www/global/en_US/pdfs/literature/ds/pkgds.pdf#page=67-68; No. of Inputs: 80; Package Reference: TQFP100_A-120_D1-140; Mounting Technology: SurfaceMount; Programmable Logic Type: PLD; MSL: MSL3-168hours; Datasheet URL: https://www.altera.com/content/dam/altera-www/global/en_US/pdfs/literature/ds/ds_m3000a.pdf; Operating Temperature Max: 70°C; Logic IC Base Number: 3128; Termination Type: SMD; Operating Temperature Range: 0°Cto+70°C; Base Number: 3128
X10 = CMP-1502-00216-1: Female High Density PCB Connector with Hex Screw WR-DSUB, Angled, 15 pins; Manufacturer: Wurth Elektronik; Contact Resistance: 30mOhm; Rated Current: 3A; Working Voltage: 60VAC; Pin Number: 15; Datasheet URL: https://katalog.we-online.de/em/datasheet/6180xx330923.pdf; Packaging: Tray; Operating Temperature: -40to85degC; Manufacturer URL: http://www.we-online.de; Mounting Technology: THT; Part Number: 618015330923; Gender: Female; Publisher: WurthElektronik; Orientation: Angled; Package Reference: 618015330923

## Sheet Power ATX.SchDoc
size A4
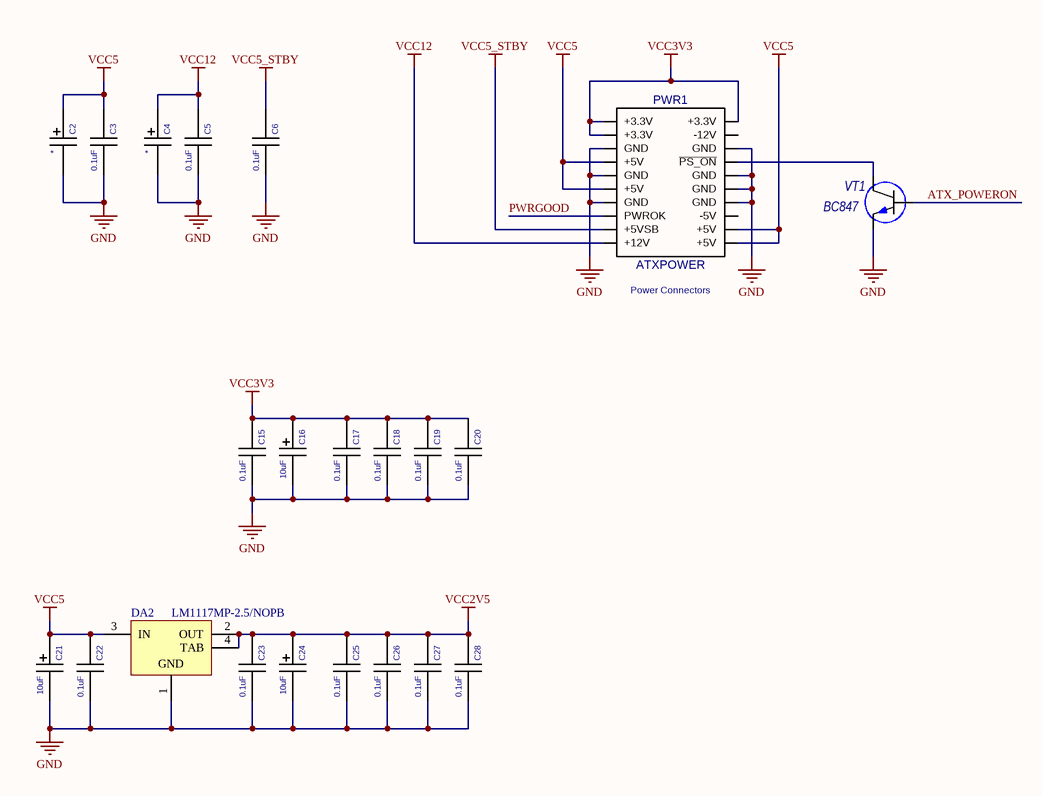
[diagram p6: Power ATX.SchDoc]

### Parts
C2  ECAPCHIPB  [EC-CHIPB]  (value not drawn)
C3  value 0.1uF  [C-CHIP]  (hidden comment: CAPCHIP)
C4  ECAPCHIPB  [EC-CHIPB]  (value not drawn)
C5  value 0.1uF  [C-CHIP]  (hidden comment: CAPCHIP)
C6  value 0.1uF  [C-CHIP]  (hidden comment: CAPCHIP)
C15  value 0.1uF  [C-CHIP]  (hidden comment: CAPCHIP)
C16  value 10uF  [EC-CHIP]  (hidden comment: ECAPCHIP)
C17  value 0.1uF  [C-CHIP]  (hidden comment: CAPCHIP)
C18  value 0.1uF  [C-CHIP]  (hidden comment: CAPCHIP)
C19  value 0.1uF  [C-CHIP]  (hidden comment: CAPCHIP)
C20  value 0.1uF  [C-CHIP]  (hidden comment: CAPCHIP)
C21  value 10uF  [EC-CHIP]  (hidden comment: ECAPCHIP)
C22  value 0.1uF  [C-CHIP]  (hidden comment: CAPCHIP)
C23  value 0.1uF  [C-CHIP]  (hidden comment: CAPCHIP)
C24  value 10uF  [EC-CHIP]  (hidden comment: ECAPCHIP)
C25  value 0.1uF  [C-CHIP]  (hidden comment: CAPCHIP)
C26  value 0.1uF  [C-CHIP]  (hidden comment: CAPCHIP)
C27  value 0.1uF  [C-CHIP]  (hidden comment: CAPCHIP)
C28  value 0.1uF  [C-CHIP]  (hidden comment: CAPCHIP)
DA2  LM1117MP-2.5/NOPB  [DCY0004A_M]
PWR1  ATXPOWER  [ATXPOWER]
VT1  BC847  [SOT-23]

### Nets
GND: C2.2 C3.2 C4.2 C5.2 C6.2 C15.2 C16.2 C17.2 C18.2 C19.2 C20.2 C21.2 C22.2 C23.2 C24.2 C25.2 C26.2 C27.2 C28.2 DA2.1(GND) PWR1.3(GND) PWR1.5(GND) PWR1.7(GND) PWR1.13(GND) PWR1.15(GND) PWR1.16(GND) PWR1.17(GND) VT1.2(emitter)
VCC2V5: C23.1 C24.1 C25.1 C26.1 C27.1 C28.1 DA2.2(OUT) DA2.4(TAB)
VCC3V3: C15.1 C16.1 C17.1 C18.1 C19.1 C20.1 PWR1.1(+3.3V) PWR1.2(+3.3V) PWR1.11(+3.3V)
VCC5: C2.1 C3.1 C21.1 C22.1 DA2.3(IN) PWR1.4(+5V) PWR1.6(+5V) PWR1.19(+5V) PWR1.20(+5V)
VCC5_STBY: C6.1 PWR1.9(+5VSB)
VCC12: C4.1 C5.1 PWR1.10(+12V)
ATX_POWERON: VT1.1(base)
PWRGOOD: PWR1.8(PWROK)
NetPWR1_14: PWR1.14(~{PS_ON}) VT1.3(collector)

Not connected (* = marked no-connect by the designer): PWR1 12(-12V) 18(-5V)

### Notes on the sheet
- (near PWR1) Power Connectors

### Library data of the parts
DA2 = CMP-0062-01660-4: 800mA Low-Dropout Linear Regulator, 4-pin SOT-223, Pb-Free; Manufacturer: Texas Instruments; PackageTopMarking: XYTT*N13A; CompType: LDO IC; PowerWise: N; High-Reliability: Y; Code_JEDEC: TO-261-AA; Code_IPC: SOT223-4; PartNumber: LM1117MP-2.5/NOPB; PackageDescription: Molded SOT-223, 6.50 x 3.56 x 1.6mm Body, 4 Lead, 2.3mm Pitch; PackageReference: DCY0004A; PinCount: 4; ComponentLink1URL: http://www.ti.com/general/docs/lit/getliterature.tsp?genericPartNumber=LM1117-N&fileType=pdf; RoHS: Y; ComponentLink1Description: Datasheet URL
C2 C4 = ECAPCHIPB: Value: *
PWR1 = ATXPOWER: Value: *

## Sheet RTC.SchDoc
size A4
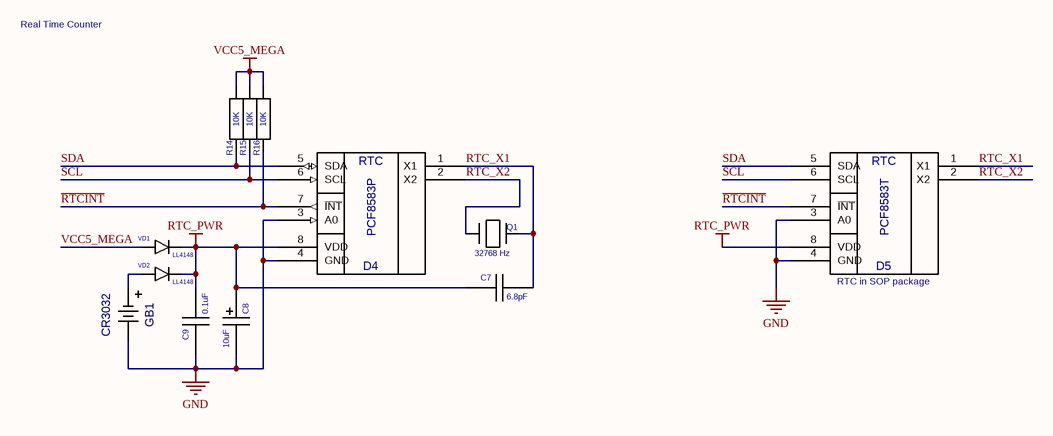
[diagram p7: RTC.SchDoc]

### Parts
C7  value 6.8pF  [C-CHIP]  (hidden comment: CAPCHIP)
C8  value 10uF  [EC-CHIP]  (hidden comment: ECAPCHIP)
C9  value 0.1uF  [C-CHIP]  (hidden comment: CAPCHIP)
D4  PCF8583P  [DIP8]
D5  PCF8583T  [PCF8583T]
GB1  value CR3032  [BAT]  (hidden comment: BAT)
Q1  value 32768 Hz  [32768]  (hidden comment: QUARTZ32768)
R14  value 10K  [R-CHIP]  (hidden comment: RESCHIP)
R15  value 10K  [R-CHIP]  (hidden comment: RESCHIP)
R16  value 10K  [R-CHIP]  (hidden comment: RESCHIP)
VD1  LL4148  [LL4148]
VD2  LL4148  [LL4148]

### Nets
GND: C8.2 C9.1 D4.3(A0) D4.4(GND) D5.3(A0) D5.4(GND) GB1.2(MINUS) Q1.3(GND)
RTC_PWR: C7.1 C8.1 C9.2 D4.8(VDD) D5.8(VDD) VD1.2(C) VD2.2(C)
VCC5_MEGA: R14.1(i/o) R15.1(i/o) R16.1(i/o) VD1.1(A)
~{RTCINT}: D4.7(~{INT}) D5.7(~{INT}) R16.2(i/o1)
RTC_X1: C7.2 D4.1(X1) D5.1(X1) Q1.1
RTC_X2: D4.2(X2) D5.2(X2) Q1.2
SCL: D4.6(SCL) D5.6(SCL) R15.2(i/o1)
SDA: D4.5(SDA) D5.5(SDA) R14.2(i/o1)
NetGB1_1: GB1.1(PLUS) VD2.1(A)

### Notes on the sheet
- Real Time Counter
- (near D5) RTC in SOP package
- (in symbol PCF8583P) RTC
- (in symbol PCF8583T) RTC

### Library data of the parts
D4 = PCF8583P: Value: *
D5 = PCF8583T: Value: *
VD1 VD2 = LL4148: Value: *

## Sheet FPGA.SchDoc
size A3 portrait
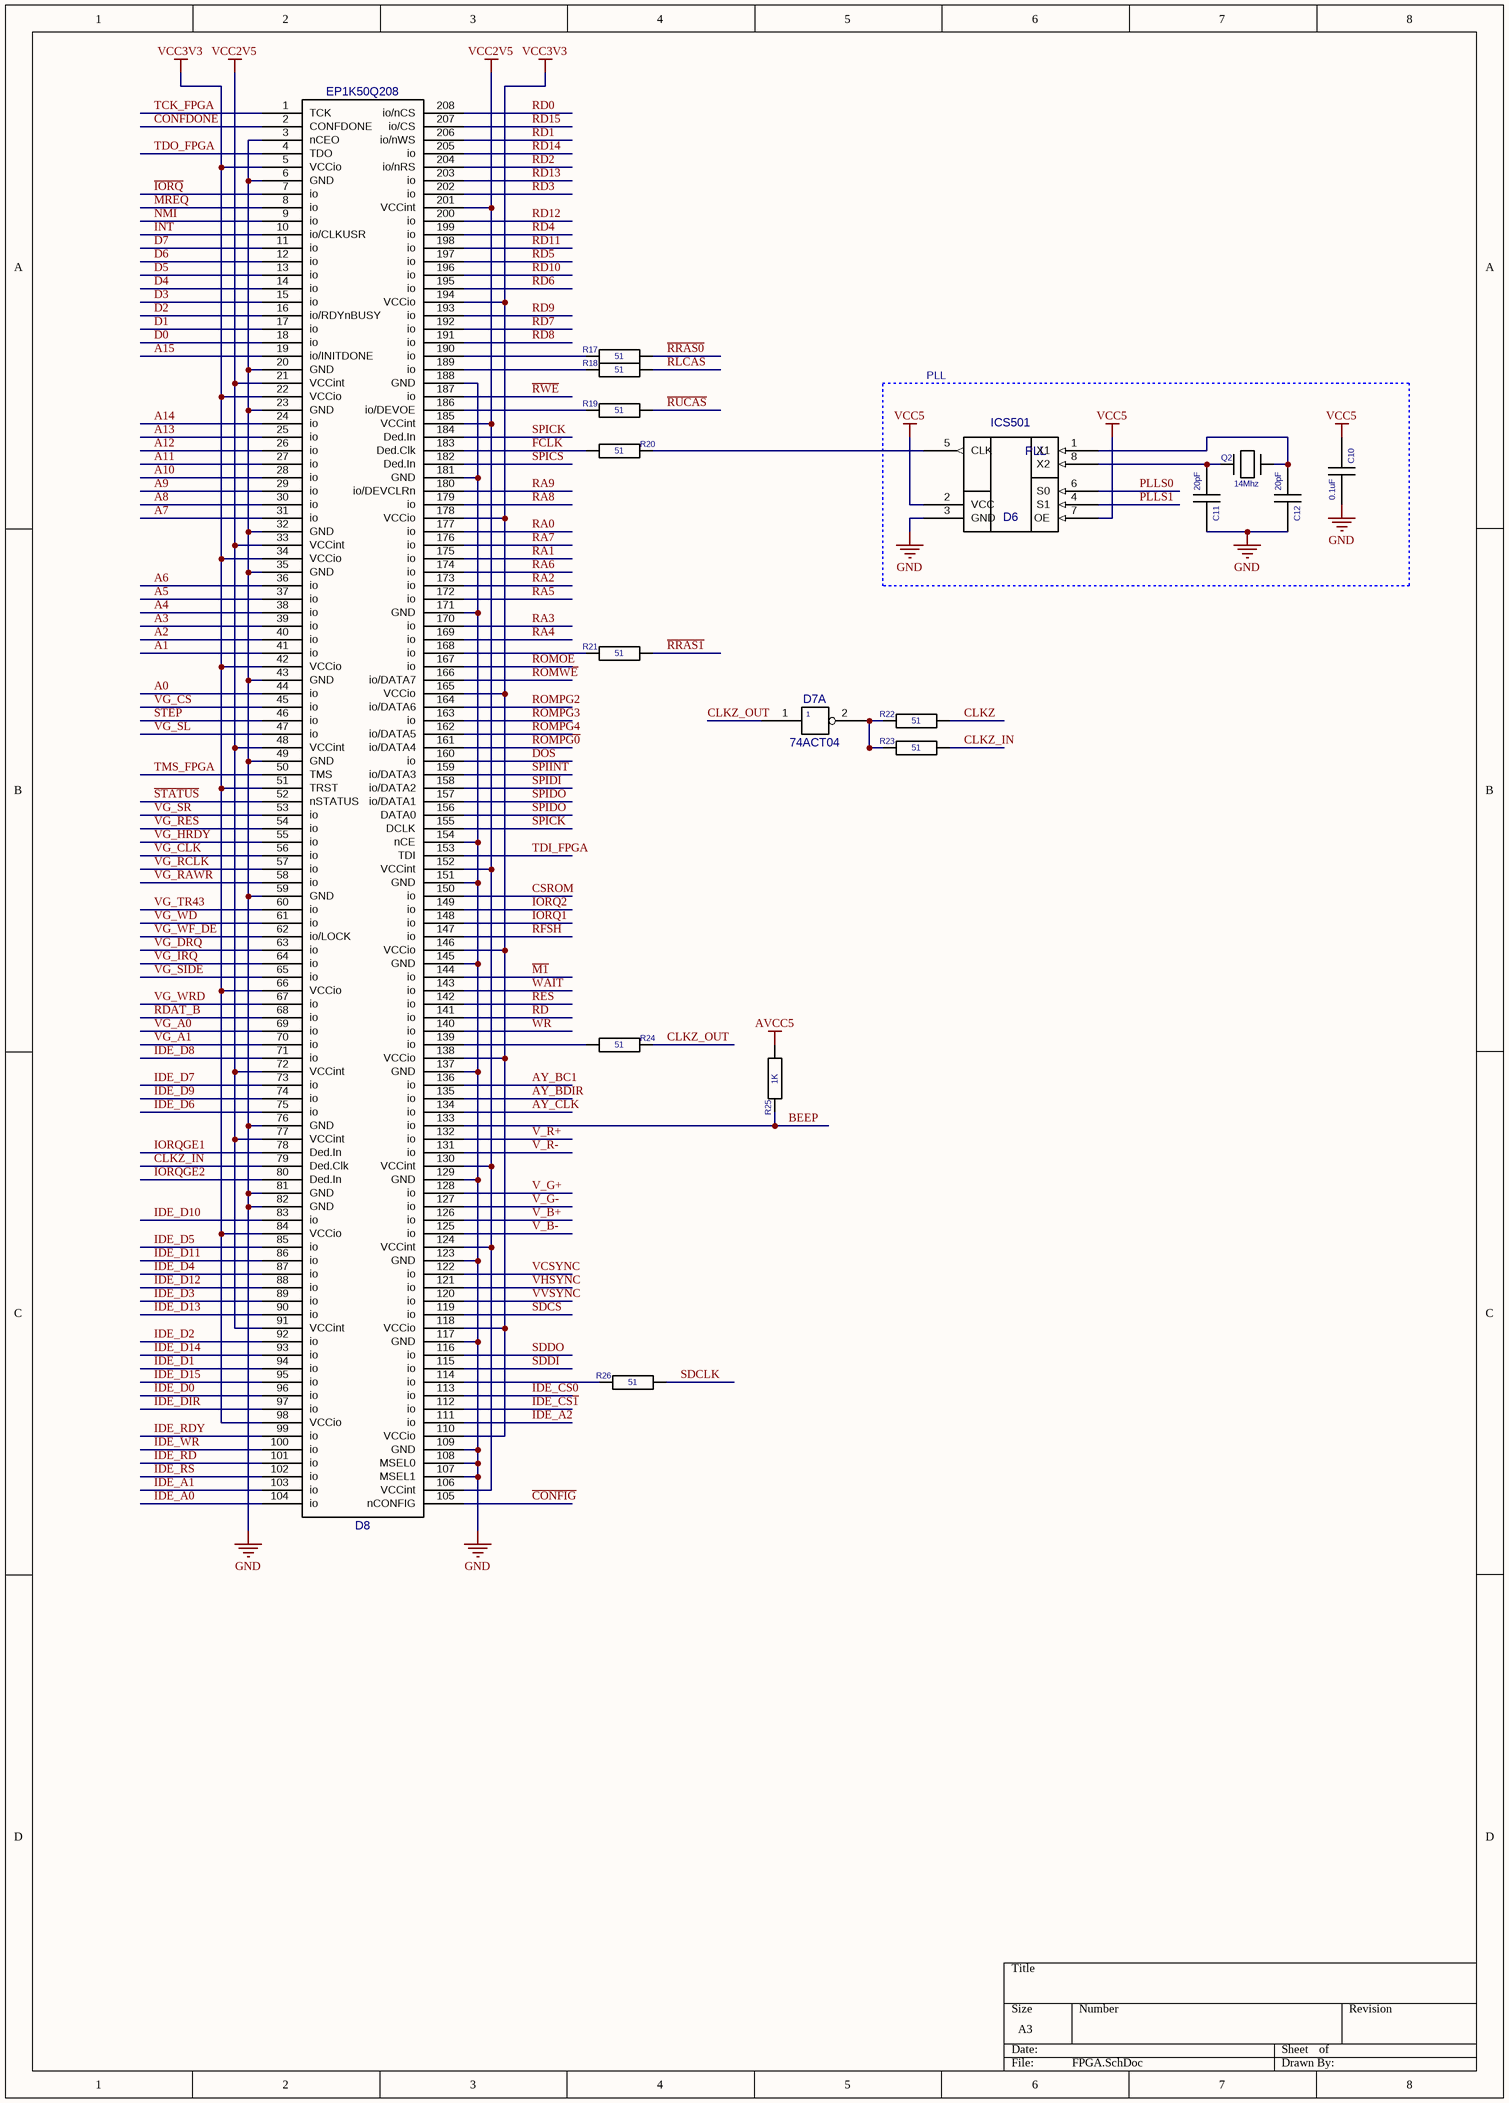
[diagram p8: FPGA.SchDoc]

### Parts
C10  value 0.1uF  [C-CHIP]  (hidden comment: CAPCHIP)
C11  value 20pF  [C-CHIP]  (hidden comment: CAPCHIP)
C12  value 20pF  [C-CHIP]  (hidden comment: CAPCHIP)
D6  ICS501  [SO8]
D7  value 74ACT04  [SO14]  (hidden comment: 04)  (part A of 6)
D8  EP1K50Q208  [PQFP208X5]
Q2  value 14Mhz  [CRYSTAL]  (hidden comment: QUARTZ)
R17  value 51  [R-CHIP]  (hidden comment: RESCHIP)
R18  value 51  [R-CHIP]  (hidden comment: RESCHIP)
R19  value 51  [R-CHIP]  (hidden comment: RESCHIP)
R20  value 51  [R-CHIP]  (hidden comment: RESCHIP)
R21  value 51  [R-CHIP]  (hidden comment: RESCHIP)
R22  value 51  [R-CHIP]  (hidden comment: RESCHIP)
R23  value 51  [R-CHIP]  (hidden comment: RESCHIP)
R24  value 51  [R-CHIP]  (hidden comment: RESCHIP)
R25  value 1K  [R-CHIP]  (hidden comment: RESCHIP)
R26  value 51  [R-CHIP]  (hidden comment: RESCHIP)

### Blocks framed on the sheet
PLL: C10-C12 D6 Q2

### Nets
AVCC5: R25.1(i/o)
GND: C10.2 C11.1 C12.1 D6.3(GND) D7.7(GND) D8.3(nCEO) D8.6(GND) D8.20(GND) D8.23(GND) D8.32(GND) D8.35(GND) D8.43(GND) D8.49(GND) D8.59(GND) D8.76(GND) D8.81(GND) D8.82(GND) D8.107(MSEL1) D8.108(MSEL0) D8.109(GND) D8.117(GND) D8.123(GND) D8.129(GND) D8.137(GND) D8.145(GND) D8.151(GND) D8.154(nCE) D8.171(GND) D8.181(GND) D8.188(GND)
VCC2V5: D8.21(VCCint) D8.33(VCCint) D8.48(VCCint) D8.72(VCCint) D8.77(VCCint) D8.91(VCCint) D8.106(VCCint) D8.124(VCCint) D8.130(VCCint) D8.152(VCCint) D8.185(VCCint) D8.201(VCCint)
VCC3V3: D8.5(VCCio) D8.22(VCCio) D8.34(VCCio) D8.42(VCCio) D8.51(TRST) D8.66(VCCio) D8.84(VCCio) D8.98(VCCio) D8.110(VCCio) D8.118(VCCio) D8.138(VCCio) D8.146(VCCio) D8.165(VCCio) D8.178(VCCio) D8.194(VCCio)
VCC5: C10.1 D6.2(VCC) D6.7(OE) D7.14(+5v)
A0: D8.44(io)
A1: D8.41(io)
A2: D8.40(io)
A3: D8.39(io)
A4: D8.38(io)
A5: D8.37(io)
A6: D8.36(io)
A7: D8.31(io)
A8: D8.30(io)
A9: D8.29(io)
A10: D8.28(io)
A11: D8.27(io)
A12: D8.26(io)
A13: D8.25(io)
A14: D8.24(io)
A15: D8.19(io/INITDONE)
AY_BC1: D8.136(io)
AY_BDIR: D8.135(io)
AY_CLK: D8.134(io)
BEEP: D8.133(io) R25.2(i/o1)
~{CONFIG}: D8.105(nCONFIG)
CLKZ: R22.1(i/o)
CLKZ_IN: D8.79(Ded.Clk) R23.1(i/o)
CLKZ_OUT: D7.1 R24.2(i/o1)
CONFDONE: D8.2(CONFDONE)
CSROM: D8.150(io)
D0: D8.18(io)
D1: D8.17(io)
D2: D8.16(io/RDYnBUSY)
D3: D8.15(io)
D4: D8.14(io)
D5: D8.13(io)
D6: D8.12(io)
D7: D8.11(io)
~{DOS}: D8.160(io)
FCLK: D8.183(Ded.Clk) R20.1(i/o)
~{IDE_CS0}: D8.113(io)
~{IDE_CS1}: D8.112(io)
~{IDE_RD}: D8.101(io)
~{IDE_RS}: D8.102(io)
~{IDE_WR}: D8.100(io)
~{INT}: D8.10(io/CLKUSR)
~{IORQ}: D8.7(io)
~{IORQ1}: D8.148(io)
~{IORQ2}: D8.149(io)
IDE_A0: D8.104(io)
IDE_A1: D8.103(io)
IDE_A2: D8.111(io)
IDE_D0: D8.96(io)
IDE_D1: D8.94(io)
IDE_D2: D8.92(io)
IDE_D3: D8.89(io)
IDE_D4: D8.87(io)
IDE_D5: D8.85(io)
IDE_D6: D8.75(io)
IDE_D7: D8.73(io)
IDE_D8: D8.71(io)
IDE_D9: D8.74(io)
IDE_D10: D8.83(io)
IDE_D11: D8.86(io)
IDE_D12: D8.88(io)
IDE_D13: D8.90(io)
IDE_D14: D8.93(io)
IDE_D15: D8.95(io)
IDE_DIR: D8.97(io)
IDE_RDY: D8.99(io)
IORQGE1: D8.78(Ded.In)
IORQGE2: D8.80(Ded.In)
~{M1}: D8.144(io)
~{MREQ}: D8.8(io)
~{NMI}: D8.9(io)
PLLS0: D6.6(S0)
PLLS1: D6.4(S1)
~{RD}: D8.141(io)
~{RDAT_B}: D8.68(io)
~{RFSH}: D8.147(io)
~{RLCAS}: R18.1(i/o)
~{ROMOE}: D8.167(io)
~{ROMPG0}: D8.161(io/DATA4)
~{ROMWE}: D8.166(io/DATA7)
~{RRAS0}: R17.1(i/o)
~{RRAS1}: R21.1(i/o)
~{RUCAS}: R19.1(i/o)
~{RWE}: D8.187(io)
RA0: D8.177(io)
RA1: D8.175(io)
RA2: D8.173(io)
RA3: D8.170(io)
RA4: D8.169(io)
RA5: D8.172(io)
RA6: D8.174(io)
RA7: D8.176(io)
RA8: D8.179(io)
RA9: D8.180(io/DEVCLRn)
RD0: D8.208(io/nCS)
RD1: D8.206(io/nWS)
RD2: D8.204(io/nRS)
RD3: D8.202(io)
RD4: D8.199(io)
RD5: D8.197(io)
RD6: D8.195(io)
RD7: D8.192(io)
RD8: D8.191(io)
RD9: D8.193(io)
RD10: D8.196(io)
RD11: D8.198(io)
RD12: D8.200(io)
RD13: D8.203(io)
RD14: D8.205(io)
RD15: D8.207(io/CS)
RES: D8.142(io)
ROMPG2: D8.164(io/DATA6)
ROMPG3: D8.163(io)
ROMPG4: D8.162(io/DATA5)
~{SDCS}: D8.119(io)
~{SPICS}: D8.182(Ded.In)
~{SPIINT}: D8.159(io/DATA3)
~{STATUS}: D8.52(nSTATUS)
SDCLK: R26.1(i/o)
SDDI: D8.115(io)
SDDO: D8.116(io)
SPICK: D8.155(DCLK) D8.184(Ded.In)
SPIDI: D8.158(io/DATA2)
SPIDO: D8.156(DATA0) D8.157(io/DATA1)
STEP: D8.46(io)
TCK_FPGA: D8.1(TCK)
TDI_FPGA: D8.153(TDI)
TDO_FPGA: D8.4(TDO)
TMS_FPGA: D8.50(TMS)
~{VG_CS}: D8.45(io)
~{VG_RES}: D8.54(io)
V_B+: D8.126(io)
V_B-: D8.125(io)
V_G+: D8.128(io)
V_G-: D8.127(io)
V_R+: D8.132(io)
V_R-: D8.131(io)
VCSYNC: D8.122(io)
VG_A0: D8.69(io)
VG_A1: D8.70(io)
VG_CLK: D8.56(io)
VG_DRQ: D8.63(io)
VG_HRDY: D8.55(io)
VG_IRQ: D8.64(io)
VG_RAWR: D8.58(io)
VG_RCLK: D8.57(io)
VG_SIDE: D8.65(io)
VG_SL: D8.47(io)
VG_SR: D8.53(io)
VG_TR43: D8.60(io)
VG_WD: D8.61(io)
VG_WF_DE: D8.62(io/LOCK)
VG_WRD: D8.67(io)
VHSYNC: D8.121(io)
VVSYNC: D8.120(io)
~{WAIT}: D8.143(io)
~{WR}: D8.140(io)
NetC11_2: C11.2 D6.8(X2) Q2.A
NetC12_2: C12.2 D6.1(X1) Q2.B
NetD6_5: D6.5(CLK) R20.2(i/o1)
NetD7_2: D7.2 R22.2(i/o1) R23.2(i/o1)
NetD8_114: D8.114(io) R26.2(i/o1)
NetD8_139: D8.139(io) R24.1(i/o)
NetD8_168: D8.168(io) R21.2(i/o1)
NetD8_186: D8.186(io/DEVOE) R19.2(i/o1)
NetD8_189: D8.189(io) R18.2(i/o1)
NetD8_190: D8.190(io) R17.2(i/o1)

### Notes on the sheet
- (in symbol ICS501) PLL

### Library data of the parts
Q2 = QUARTZ: Crystal
D6 = ICS501: Value: *
D8 = EP1K50Q208: Value: *

## Sheet MCU.SchDoc
size 381 x 241 mm
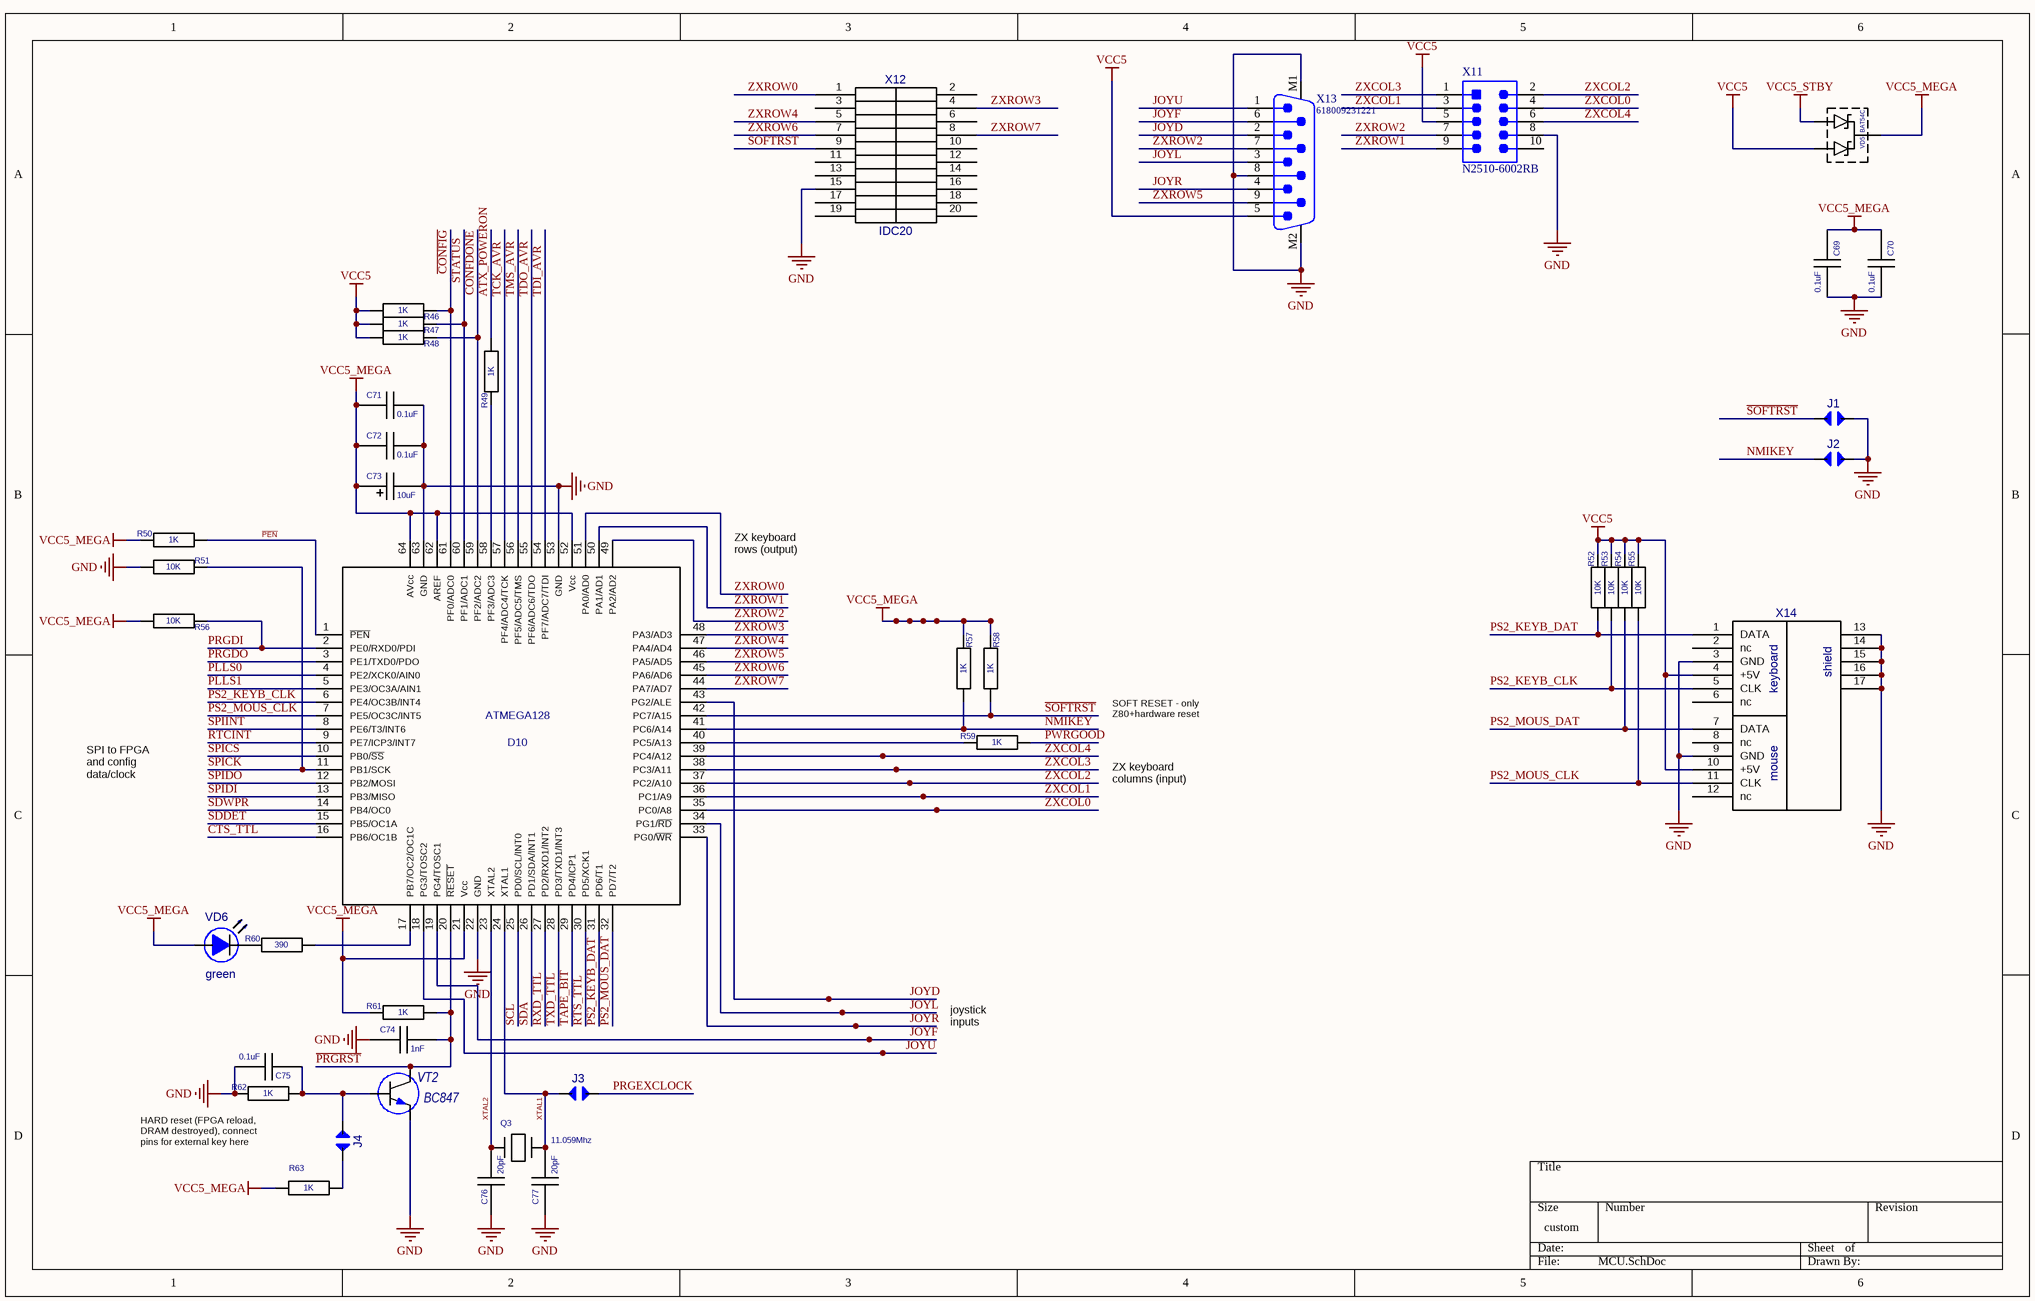
[diagram p9: MCU.SchDoc]

### Parts
C69  value 0.1uF  [C-CHIP]  (hidden comment: CAPCHIP)
C70  value 0.1uF  [C-CHIP]  (hidden comment: CAPCHIP)
C71  value 0.1uF  [C-CHIP]  (hidden comment: CAPCHIP)
C72  value 0.1uF  [C-CHIP]  (hidden comment: CAPCHIP)
C73  value 10uF  [EC-CHIP]  (hidden comment: ECAPCHIP)
C74  value 1nF  [C-CHIP]  (hidden comment: CAPCHIP)
C75  value 0.1uF  [C-CHIP]  (hidden comment: CAPCHIP)
C76  value 20pF  [C-CHIP]  (hidden comment: CAPCHIP)
C77  value 20pF  [C-CHIP]  (hidden comment: CAPCHIP)
D10  ATMEGA128  [TQFP64X8]
J1  JUMPER  [JUMPER]  (value not drawn)
J2  JUMPER  [JUMPER]  (value not drawn)
J3  JUMPER  [JUMPER]  (value not drawn)
J4  JUMPER  [JUMPER]  (value not drawn)
Q3  value 11.059Mhz  [CRYSTAL]  (hidden comment: QUARTZ)
R46  value 1K  [R-CHIP]  (hidden comment: RESCHIP)
R47  value 1K  [R-CHIP]  (hidden comment: RESCHIP)
R48  value 1K  [R-CHIP]  (hidden comment: RESCHIP)
R49  value 1K  [R-CHIP]  (hidden comment: RESCHIP)
R50  value 1K  [R-CHIP]  (hidden comment: RESCHIP)
R51  value 10K  [R-CHIP]  (hidden comment: RESCHIP)
R52  value 10K  [R-CHIP]  (hidden comment: RESCHIP)
R53  value 10K  [R-CHIP]  (hidden comment: RESCHIP)
R54  value 10K  [R-CHIP]  (hidden comment: RESCHIP)
R55  value 10K  [R-CHIP]  (hidden comment: RESCHIP)
R56  value 10K  [R-CHIP]  (hidden comment: RESCHIP)
R57  value 1K  [R-CHIP]  (hidden comment: RESCHIP)
R58  value 1K  [R-CHIP]  (hidden comment: RESCHIP)
R59  value 1K  [R-CHIP]  (hidden comment: RESCHIP)
R60  value 390  [R-CHIP]  (hidden comment: RESCHIP)
R61  value 1K  [R-CHIP]  (hidden comment: RESCHIP)
R62  value 1K  [R-CHIP]  (hidden comment: RESCHIP)
R63  value 1K  [R-CHIP]  (hidden comment: RESCHIP)
VD5  BAT54C  [SOT-23]
VD6  value green  [LED100]  (hidden comment: LED)
VT2  BC847  [SOT-23]
X11  N2510-6002RB  [3M-N2510-6002-10_V]
X12  IDC20  [IDC20]
X13  618009231221  [618009231221]
X14  KEYB-MOUSE  [MDD-6FR]  (value not drawn)

### Nets
GND: C69.2 C70.2 C71.2 C72.2 C73.2 C74.1 C75.2 C76.1 C77.1 D10.22(GND) D10.53(GND) D10.63(GND) J1.1 J2.1 R51.1(i/o) R62.2(i/o1) VT2.2(emitter) X11.8 X12.15 X13.8 X13.M1 X13.M2 X14.3(GND) X14.9(GND) X14.13(shield) X14.14(shield) X14.15(shield) X14.16(shield) X14.17(shield)
VCC5: R46.1(i/o) R47.1(i/o) R48.1(i/o) R52.2(i/o1) R53.2(i/o1) R54.2(i/o1) R55.2(i/o1) VD5.2 X11.5 X13.5 X14.4(+5V) X14.10(+5V)
VCC5_MEGA: C69.1 C70.1 C71.1 C72.1 C73.1 D10.21(Vcc) D10.52(Vcc) D10.62(AREF) D10.64(AVcc) R50.2(i/o1) R56.1(i/o) R57.2(i/o1) R58.2(i/o1) R61.2(i/o1) R63.2(i/o1) VD5.3 VD6.A
VCC5_STBY: VD5.1
ATX_POWERON: R49.1(i/o)
~{CONFIG}: D10.61(PF0/ADC0) R46.2(i/o1)
CONFDONE: D10.59(PF2/ADC2) R48.2(i/o1)
CTS_TTL: D10.16(PB6/OC1B)
JOYD: D10.43(PG2/ALE) X13.2
JOYF: D10.19(PG4/TOSC1) X13.6
JOYL: D10.34(PG1/~{RD}) X13.3
JOYR: D10.33(PG0/~{WR}) X13.4
JOYU: D10.18(PG3/TOSC2) X13.1
NMIKEY: D10.41(PC6/A14) J2.0 R57.1(i/o)
~{PEN}: D10.1(~{PEN}) R50.1(i/o)
~{PRGRST}: C74.2 D10.20(~{RESET}) R61.1(i/o) VT2.3(collector)
PLLS0: D10.4(PE2/XCK0/AIN0)
PLLS1: D10.5(PE3/OC3A/AIN1)
PRGDI: D10.2(PE0/RXD0/PDI) R56.2(i/o1)
PRGDO: D10.3(PE1/TXD0/PDO)
PRGEXCLOCK: J3.1
PS2_KEYB_CLK: D10.6(PE4/OC3B/INT4) R53.1(i/o) X14.5(CLK)
PS2_KEYB_DAT: D10.31(PD6/T1) R52.1(i/o) X14.1(DATA)
PS2_MOUS_CLK: D10.7(PE5/OC3C/INT5) R55.1(i/o) X14.11(CLK)
PS2_MOUS_DAT: D10.32(PD7/T2) R54.1(i/o) X14.7(DATA)
PWRGOOD: R59.1(i/o)
~{RTCINT}: D10.9(PE7/ICP3/INT7)
RTS_TTL: D10.30(PD5/XCK1)
RXD_TTL: D10.27(PD2/RXD1/INT2)
~{SOFTRST}: D10.42(PC7/A15) J1.0 R58.1(i/o) X12.9
~{SPICS}: D10.10(PB0/~{SS})
~{SPIINT}: D10.8(PE6/T3/INT6)
~{STATUS}: D10.60(PF1/ADC1) R47.2(i/o1)
SCL: D10.25(PD0/SCL/INT0)
SDA: D10.26(PD1/SDA/INT1)
SDDET: D10.15(PB5/OC1A)
SDWPR: D10.14(PB4/OC0)
SPICK: D10.11(PB1/SCK) R51.2(i/o1)
SPIDI: D10.13(PB3/MISO)
SPIDO: D10.12(PB2/MOSI)
TAPE_BIT: D10.29(PD4/ICP1)
TCK_AVR: D10.57(PF4/ADC4/TCK)
TDI_AVR: D10.54(PF7/ADC7/TDI)
TDO_AVR: D10.55(PF6/ADC6/TDO)
TMS_AVR: D10.56(PF5/ADC5/TMS)
TXD_TTL: D10.28(PD3/TXD1/INT3)
XTAL1: C77.2 D10.24(XTAL1) J3.0 Q3.B
XTAL2: C76.2 D10.23(XTAL2) Q3.A
ZXCOL0: D10.35(PC0/A8) X11.4
ZXCOL1: D10.36(PC1/A9) X11.3
ZXCOL2: D10.37(PC2/A10) X11.2
ZXCOL3: D10.38(PC3/A11) X11.1
ZXCOL4: D10.39(PC4/A12) X11.6
ZXROW0: D10.51(PA0/AD0) X12.1
ZXROW1: D10.50(PA1/AD1) X11.9
ZXROW2: D10.49(PA2/AD2) X11.7 X13.7
ZXROW3: D10.48(PA3/AD3) X12.4
ZXROW4: D10.47(PA4/AD4) X12.5
ZXROW5: D10.46(PA5/AD5) X13.9
ZXROW6: D10.45(PA6/AD6) X12.7
ZXROW7: D10.44(PA7/AD7) X12.8
NetC75_1: C75.1 J4.0 R62.1(i/o) VT2.1(base)
NetD10_17: D10.17(PB7/OC2/OC1C) R60.1(i/o)
NetD10_40: D10.40(PC5/A13) R59.2(i/o1)
NetD10_58: D10.58(PF3/ADC3) R49.2(i/o1)
NetJ4_1: J4.1 R63.1(i/o)
NetR60_2: R60.2(i/o1) VD6.K

Not connected (* = marked no-connect by the designer): X11 10; X12 2 3 6 10 11 12 13 14 16 17 18 19 20; X14 2(nc) 6(nc) 8(nc) 12(nc)

### Notes on the sheet
- ZX keyboard
  rows (output)
- SOFT RESET - only
  Z80+hardware reset
- SPI to FPGA
  and config
  data/clock
- ZX keyboard
  columns (input)
- joystick
  inputs
- HARD reset (FPGA reload,
  DRAM destroyed), connect
  pins for external key here
- (in symbol KEYB-MOUSE) keyboard; mouse

### Library data of the parts
J1 = JUMPER: Soft Reset Key
J2 = JUMPER: NMI Key; Value: *
J3 = JUMPER: externalclock; Value: *
J4 = JUMPER: Hard Reset Key; Value: *
Q3 = QUARTZ: Crystal
VD6 = LED: Light Emitting Diode
X11 = CMP-2000-06794-1: Male Header, Pitch 2.54 mm, 2 x 5 Postion, Height 9.91 mm, Tail Length 2.84 mm, -55 to 105 degC, RoHS, Bulk; PartNumber: N2510; Manufacturer: 3M; Package Version: Rev. M, 08/2014; Rad Hard: No; No. of Rows: 2; Number of Contacts: 10; Pitch: 2.54mm; Termination Method: Solder; Manufacturer URL: http://www.3m.com/; Package Description: 10-Pin Through Hole Device, Body 20.02 x 8.59 mm, Pitch 2.54 mm; Gender: Male; Number of Rows: 2; Orientation: Straight; Contact Plating: GoldOverNickel; Packaging: Rail/Tube; Mounting Technology: ThroughHole; Datasheet URL: https://datasheet.ciiva.com/11746/0900766b807b18da-11746957.pdf; Package Reference: N2510-6002-10; Datasheet Version: 05/2007; No. of Positions: 10; Package URL: http://multimedia.3m.com/mws/media/330367O/3mtm-100-in-4-wall-hdr-rohs-lp-straightra-hitemp-ts0770.pdf; Type: ShroudedHeader
X13 = CMP-1502-00284-1: Male PCB Connector with Hex Screw WR-DSUB, 8.08 mm, Angled, 9 pins; Manufacturer: Wurth Elektronik; Working Voltage: 125VAC; Contact Resistance: 30mOhm; Rated Current: 3A; Pin Number: 9; Manufacturer URL: http://www.we-online.de; Orientation: Angled; Operating Temperature: -40to85degC; Package Reference: 618009231221; Gender: Male; Mounting Technology: THT; Publisher: WurthElektronik; Datasheet URL: https://katalog.we-online.de/em/datasheet/6180xx231221.pdf; Part Number: 618009231221; Packaging: Tray
D10 = ATMEGA128: Value: *
VD5 = BAT54C: Value: *
X12 = IDC20: Value: *
X14 = KEYB-MOUSE: Value: *

## Sheet IDE.SchDoc
size A4

## Sheet FDC.SchDoc
size A4
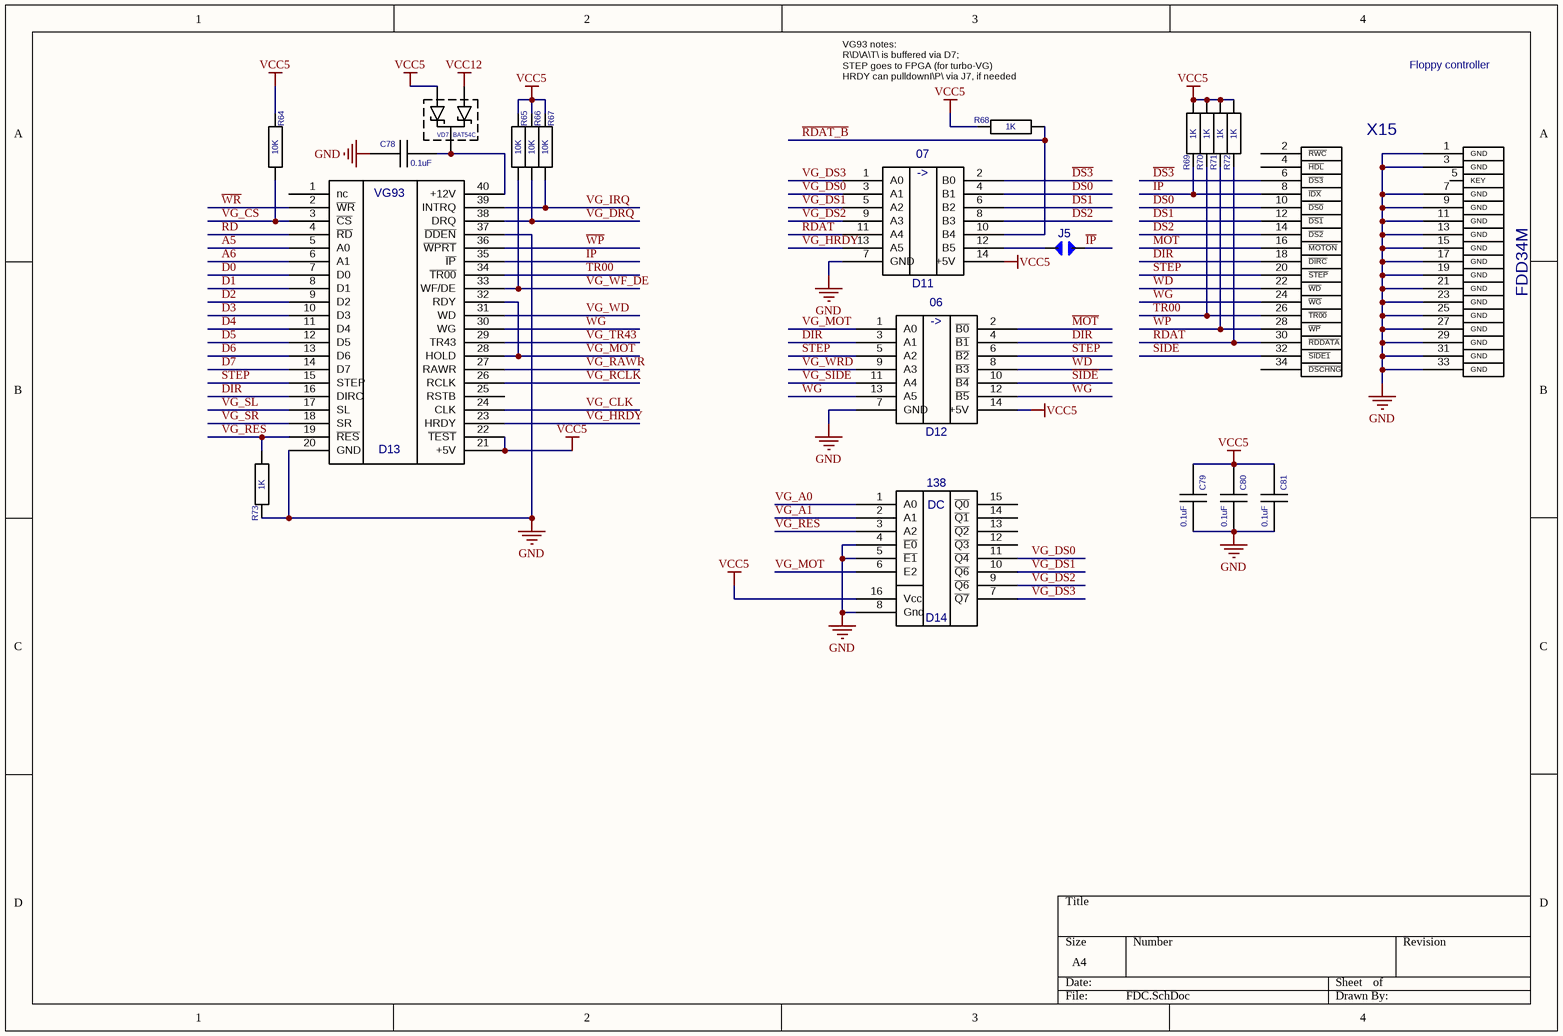
[diagram p10: FDC.SchDoc]

### Parts
C78  value 0.1uF  [C-CHIP]  (hidden comment: CAPCHIP)
C79  value 0.1uF  [C-CHIP]  (hidden comment: CAPCHIP)
C80  value 0.1uF  [C-CHIP]  (hidden comment: CAPCHIP)
C81  value 0.1uF  [C-CHIP]  (hidden comment: CAPCHIP)
D11  07  [SO14]
D12  06  [SO14]
D13  KR1818VG93  [DIP40]  (value not drawn)
D14  138  [SO16]
J5  JUMPER  [JUMPER]  (value not drawn)
R64  value 10K  [R-CHIP]  (hidden comment: RESCHIP)
R65  value 10K  [R-CHIP]  (hidden comment: RESCHIP)
R66  value 10K  [R-CHIP]  (hidden comment: RESCHIP)
R67  value 10K  [R-CHIP]  (hidden comment: RESCHIP)
R68  value 1K  [R-CHIP]  (hidden comment: RESCHIP)
R69  value 1K  [R-CHIP]  (hidden comment: RESCHIP)
R70  value 1K  [R-CHIP]  (hidden comment: RESCHIP)
R71  value 1K  [R-CHIP]  (hidden comment: RESCHIP)
R72  value 1K  [R-CHIP]  (hidden comment: RESCHIP)
R73  value 1K  [R-CHIP]  (hidden comment: RESCHIP)
VD7  BAT54C  [SOT-23]
X15  FDD34M  [FDD34M]

### Nets
GND: C78.1 C79.2 C80.2 C81.2 D11.7(GND) D12.7(GND) D13.20(GND) D13.37(~{DDEN}) D14.4(~{E0}) D14.5(~{E1}) D14.8(Gnd) R73.2(i/o1) X15.1(GND) X15.3(GND) X15.7(GND) X15.9(GND) X15.11(GND) X15.13(GND) X15.15(GND) X15.17(GND) X15.19(GND) X15.21(GND) X15.23(GND) X15.25(GND) X15.27(GND) X15.29(GND) X15.31(GND) X15.33(GND)
VCC5: C79.1 C80.1 C81.1 D11.14(+5V) D12.14(+5V) D13.21(+5V) D13.22(~{TEST}) D14.16(Vcc) R64.2(i/o1) R65.2(i/o1) R66.2(i/o1) R67.2(i/o1) R68.2(i/o1) R69.1(i/o) R70.1(i/o) R71.1(i/o) R72.1(i/o) VD7.2
VCC12: VD7.1
A5: D13.5(A0)
A6: D13.6(A1)
D0: D13.7(D0)
D1: D13.8(D1)
D2: D13.9(D2)
D3: D13.10(D3)
D4: D13.11(D4)
D5: D13.12(D5)
D6: D13.13(D6)
D7: D13.14(D7)
~{DIR}: D12.4(~{B1}) X15.18(~{DIRC})
~{DS0}: D11.4(B1) X15.10(~{DS0})
~{DS1}: D11.6(B2) X15.12(~{DS1})
~{DS2}: D11.8(B3) X15.14(~{DS2})
~{DS3}: D11.2(B0) X15.6(~{DS3})
DIR: D12.3(A1) D13.16(DIRC)
~{IP}: D13.35(~{IP}) J5.1 R69.2(i/o1) X15.8(~{IDX})
~{MOT}: D12.2(~{B0}) X15.16(~{MOTON})
~{RD}: D13.4(~{RD})
~{RDAT}: D11.11(A4) R72.2(i/o1) X15.30(~{RDDATA})
~{RDAT_B}: D11.10(B4) R68.1(i/o)
~{SIDE}: D12.10(~{B4}) X15.32(~{SIDE1})
~{STEP}: D12.6(~{B2}) X15.20(~{STEP})
STEP: D12.5(A2) D13.15(STEP)
~{TR00}: D13.34(~{TR00}) R70.2(i/o1) X15.26(~{TR00})
~{VG_CS}: D13.3(~{CS}) R64.1(i/o)
~{VG_RES}: D13.19(~{RES}) D14.3(A2) R73.1(i/o)
VG_A0: D14.1(A0)
VG_A1: D14.2(A1)
VG_CLK: D13.24(CLK)
VG_DRQ: D13.38(DRQ) R66.1(i/o)
VG_DS0: D11.3(A1) D14.11(~{Q4})
VG_DS1: D11.5(A2) D14.10(~{Q6})
VG_DS2: D11.9(A3) D14.9(~{Q6})
VG_DS3: D11.1(A0) D14.7(~{Q7})
VG_HRDY: D11.13(A5) D13.23(HRDY)
VG_IRQ: D13.39(INTRQ) R67.1(i/o)
VG_MOT: D12.1(A0) D13.28(HOLD) D13.32(RDY) D14.6(E2)
VG_RAWR: D13.27(RAWR)
VG_RCLK: D13.26(RCLK)
VG_SIDE: D12.11(A4)
VG_SL: D13.17(SL)
VG_SR: D13.18(SR)
VG_TR43: D13.29(TR43)
VG_WD: D13.31(WD)
VG_WF_DE: D13.33(WF/DE) R65.1(i/o)
VG_WRD: D12.9(A3)
~{WD}: D12.8(~{B3}) X15.22(~{WD})
~{WG}: D12.12(~{B5}) X15.24(~{WG})
~{WP}: D13.36(~{WPRT}) R71.2(i/o1) X15.28(~{WP})
~{WR}: D13.2(~{WR})
WG: D12.13(A5) D13.30(WG)
NetC78_2: C78.2 D13.40(+12V) VD7.3
NetD11_12: D11.12(B5) J5.0

Not connected (* = marked no-connect by the designer): D13 1(nc) 25(RSTB); D14 12(~{Q3}) 13(~{Q2}) 14(~{Q1}) 15(~{Q0}); X15 2(~{RWC}) 4(~{HDL}) 5(KEY) 34(~{DSCHNG})

### Notes on the sheet
- (near R68) VG93 notes:
  R\D\A\T\ is buffered via D7;
  STEP goes to FPGA (for turbo-VG)
  HRDY can pulldownI\P\ via J7, if needed
- Floppy controller
- (in symbol 06) ->
- (in symbol 07) ->
- (in symbol 138) DC
- (in symbol KR1818VG93) VG93

### Library data of the parts
J5 = JUMPER: HLT->~IP
D11 = 07: Value: *
D12 = 06: Value: *
D13 = KR1818VG93: Value: *
D14 = 138: Value: *
VD7 = BAT54C: Value: *
X15 = FDD34M: Value: *

## Sheet Memory.SchDoc
size A4
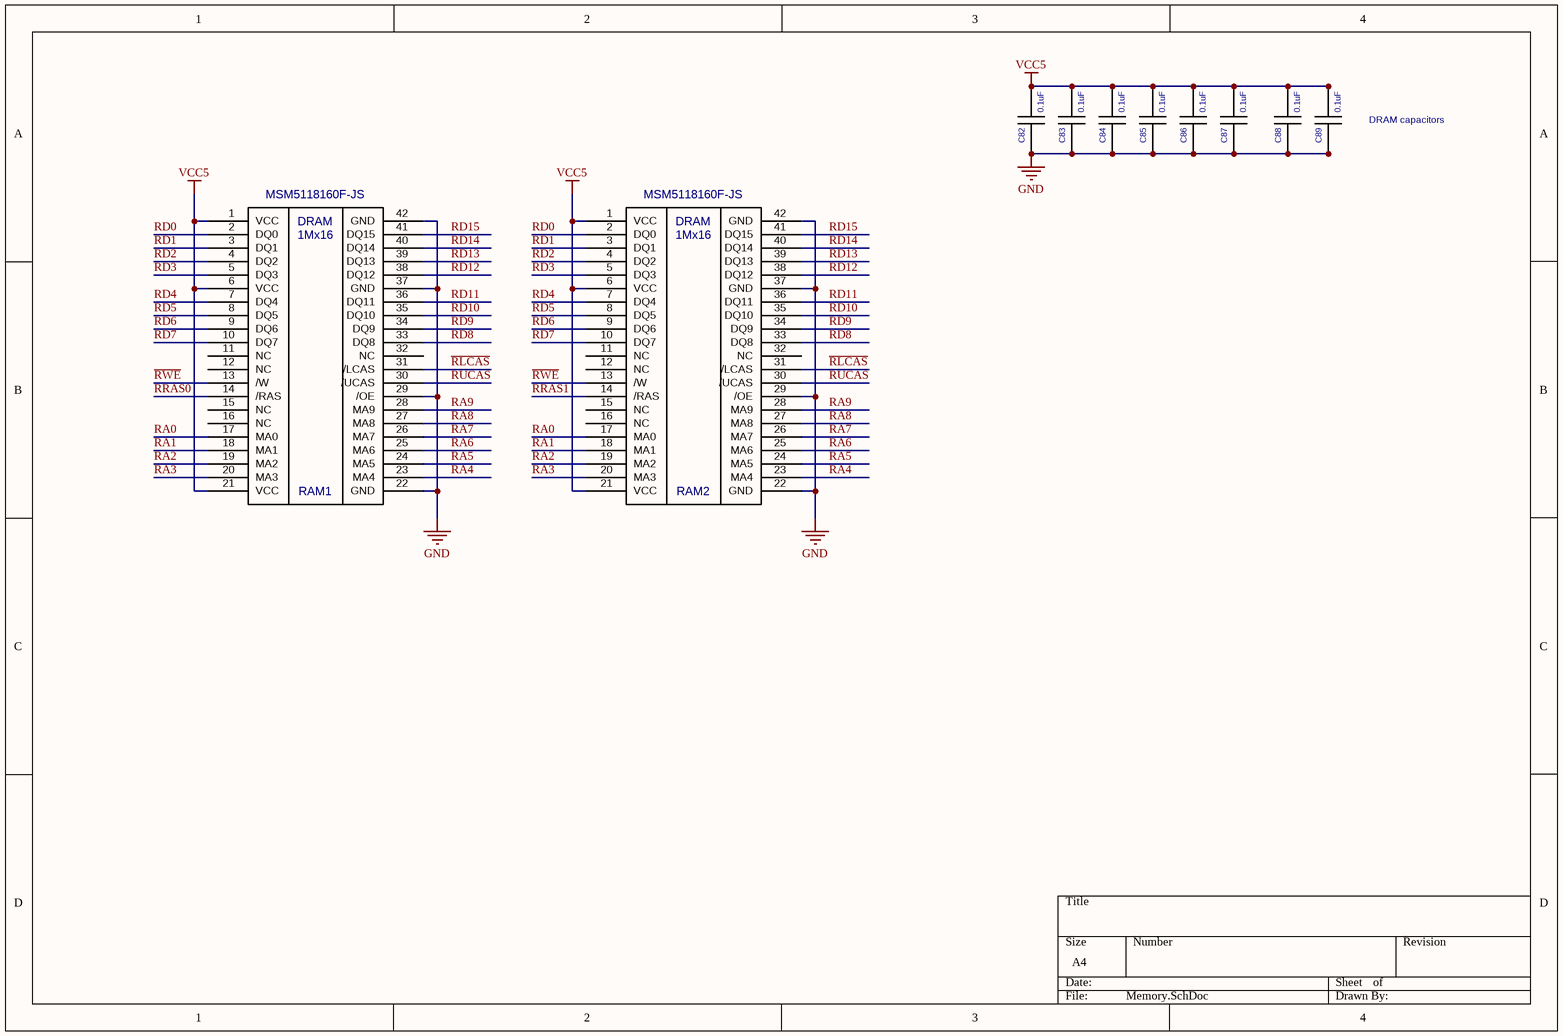
[diagram p11: Memory.SchDoc]

### Parts
C82  value 0.1uF  [C-CHIP]  (hidden comment: CAPCHIP)
C83  value 0.1uF  [C-CHIP]  (hidden comment: CAPCHIP)
C84  value 0.1uF  [C-CHIP]  (hidden comment: CAPCHIP)
C85  value 0.1uF  [C-CHIP]  (hidden comment: CAPCHIP)
C86  value 0.1uF  [C-CHIP]  (hidden comment: CAPCHIP)
C87  value 0.1uF  [C-CHIP]  (hidden comment: CAPCHIP)
C88  value 0.1uF  [C-CHIP]  (hidden comment: CAPCHIP)
C89  value 0.1uF  [C-CHIP]  (hidden comment: CAPCHIP)
RAM1  MSM5118160F-JS  [SOJ42]
RAM2  MSM5118160F-JS  [SOJ42]

### Nets
GND: C82.1 C83.1 C84.1 C85.1 C86.1 C87.1 C88.1 C89.1 RAM1.22(GND) RAM1.29(/OE) RAM1.37(GND) RAM1.42(GND) RAM2.22(GND) RAM2.29(/OE) RAM2.37(GND) RAM2.42(GND)
VCC5: C82.2 C83.2 C84.2 C85.2 C86.2 C87.2 C88.2 C89.2 RAM1.1(VCC) RAM1.6(VCC) RAM1.21(VCC) RAM2.1(VCC) RAM2.6(VCC) RAM2.21(VCC)
~{RLCAS}: RAM1.31(/LCAS) RAM2.31(/LCAS)
~{RRAS0}: RAM1.14(/RAS)
~{RRAS1}: RAM2.14(/RAS)
~{RUCAS}: RAM1.30(/UCAS) RAM2.30(/UCAS)
~{RWE}: RAM1.13(/W) RAM2.13(/W)
RA0: RAM1.17(MA0) RAM2.17(MA0)
RA1: RAM1.18(MA1) RAM2.18(MA1)
RA2: RAM1.19(MA2) RAM2.19(MA2)
RA3: RAM1.20(MA3) RAM2.20(MA3)
RA4: RAM1.23(MA4) RAM2.23(MA4)
RA5: RAM1.24(MA5) RAM2.24(MA5)
RA6: RAM1.25(MA6) RAM2.25(MA6)
RA7: RAM1.26(MA7) RAM2.26(MA7)
RA8: RAM1.27(MA8) RAM2.27(MA8)
RA9: RAM1.28(MA9) RAM2.28(MA9)
RD0: RAM1.2(DQ0) RAM2.2(DQ0)
RD1: RAM1.3(DQ1) RAM2.3(DQ1)
RD2: RAM1.4(DQ2) RAM2.4(DQ2)
RD3: RAM1.5(DQ3) RAM2.5(DQ3)
RD4: RAM1.7(DQ4) RAM2.7(DQ4)
RD5: RAM1.8(DQ5) RAM2.8(DQ5)
RD6: RAM1.9(DQ6) RAM2.9(DQ6)
RD7: RAM1.10(DQ7) RAM2.10(DQ7)
RD8: RAM1.33(DQ8) RAM2.33(DQ8)
RD9: RAM1.34(DQ9) RAM2.34(DQ9)
RD10: RAM1.35(DQ10) RAM2.35(DQ10)
RD11: RAM1.36(DQ11) RAM2.36(DQ11)
RD12: RAM1.38(DQ12) RAM2.38(DQ12)
RD13: RAM1.39(DQ13) RAM2.39(DQ13)
RD14: RAM1.40(DQ14) RAM2.40(DQ14)
RD15: RAM1.41(DQ15) RAM2.41(DQ15)

Not connected (* = marked no-connect by the designer): RAM1 11(NC) 12(NC) 15(NC) 16(NC) 32(NC); RAM2 11(NC) 12(NC) 15(NC) 16(NC) 32(NC)

### Notes on the sheet
- (near C89) DRAM capacitors
- (in symbol MSM5118160F-JS) DRAM; 1Mx16

### Library data of the parts
RAM1 RAM2 = MSM5118160F-JS: Value: *